# EAGLE design Basic (EAGLE 6.5.0)

## Sheet 1 of 7
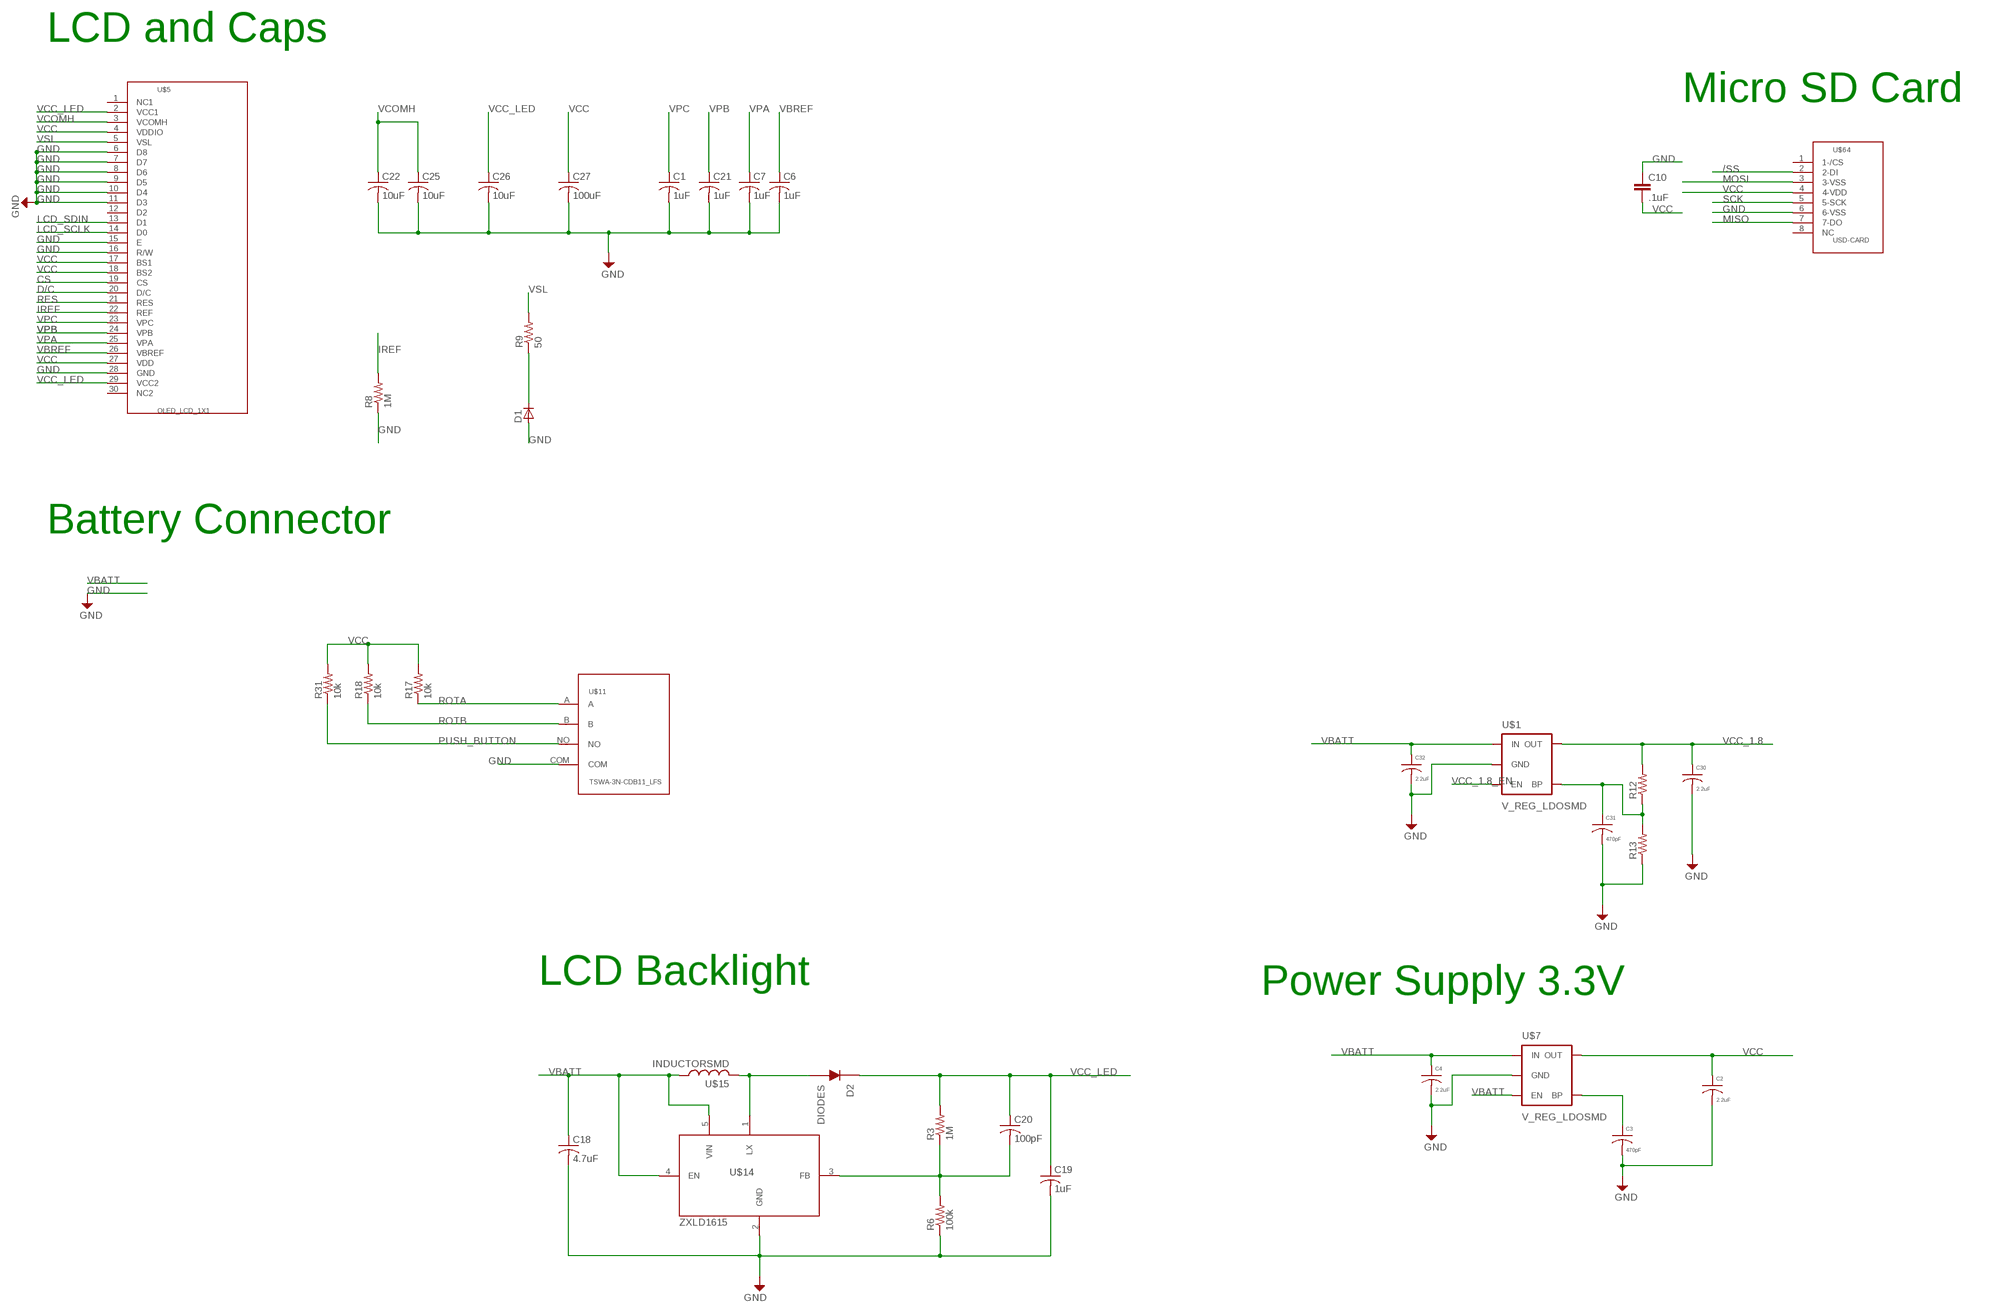
[diagram p0: schematic, sheet 1]

### Parts
C1  1uF  C-USC0402  [C0402]
C2  2.2uF  C0402  [C0402]
C3  470pF  C0402  [C0402]
C4  2.2uF  C0402  [C0402]
C6  1uF  C-USC0402  [C0402]
C7  1uF  C-USC0402  [C0402]
C10  .1uF  C-EUC0402  [C0402]
C18  4.7uF  C-USC0805K  [C0805K]
C19  1uF  C-USC1206  [C1206]
C20  100pF  C-USC0402  [C0402]
C21  1uF  C-USC0402  [C0402]
C22  10uF  C-USC0603  [C0603]
C25  10uF  C-USC0603  [C0603]
C26  10uF  C-USC0603  [C0603]
C27  100uF  C-USC0603  [C0603]
C30  2.2uF  C0603  [C0603]
C31  470pF  C0402  [C0402]
C32  2.2uF  C0603  [C0603]
D1  D-SOD123  [SOD123]
D2  DIODES  [SOD-123]
R3  1M  R-US_R0805  [R0805]
R6  100k  R-US_R0805  [R0805]
R8  1M  R-US_R0603  [R0603]
R9  50  R-US_R0603  [R0603]
R12  R-US_R0402  [R0402]
R13  R-US_R0402  [R0402]
R17  10k  R-US_R0402  [R0402]
R18  10k  R-US_R0402  [R0402]
R31  10k  R-US_R0402  [R0402]
U$1  V_REG_LDOSMD  [SOT23-5]
U$5  OLED_LCD_1X1  [30ZIF]
U$7  V_REG_LDOSMD  [SOT23-5]
U$11  TSWA-3N-CDB11_LFS  [TSWA-3N-CB11_LFS]
U$14  ZXLD1615  [SOT23-5L]
U$15  INDUCTORSMD  [INDUCTORSMD1]
U$64  USD-CARD  [502774-0891]

### Nets
/SS: U$64.2(2-DI) ; also sheet 2
CS: U$5.19(CS) ; also sheet 2
D/C: U$5.20(D/C) ; also sheet 2
GND: C1.2 C2.2 C3.2 C4.2 C6.2 C7.2 C10.1 C18.2 C19.2 C21.2 C22.2 C25.2 C26.2 C27.2 C30.2 C31.2 C32.2 D1.2(A) R6.1 R8.1 R13.1 U$1.2(GND) U$5.6(D8) U$5.7(D7) U$5.8(D6) U$5.9(D5) U$5.10(D4) U$5.11(D3) U$5.15(E) U$5.16(R/W) U$5.28(GND) U$7.2(GND) U$11.COM U$14.2(GND) U$64.6(6-VSS) ; also sheet 2,3,6,7
IREF: R8.2 U$5.22(REF)
LCD_SCLK: U$5.14(D0) ; also sheet 2
LCD_SDIN: U$5.13(D1) ; also sheet 2
MISO: U$64.7(7-DO) ; also sheet 2
MOSI: U$64.3(3-VSS) ; also sheet 2
N$2: C3.1 U$7.4(BP)
N$3: C20.2 R3.1 R6.2 U$14.3(FB)
N$5: D1.1(C) R9.1
N$9: D2.1(A1) U$14.1(LX) U$15.2
N$50: C31.1 R12.1 R13.2 U$1.4(BP)
PUSH_BUTTON: R31.1 U$11.NO ; also sheet 2
RES: U$5.21(RES) ; also sheet 2
ROTA: R17.1 U$11.A ; also sheet 2
ROTB: R18.1 U$11.B ; also sheet 2
SCK: U$64.5(5-SCK) ; also sheet 2
VBATT: C4.1 C18.1 C32.1 U$1.1(IN) U$7.1(IN) U$7.3(EN) U$14.4(EN) U$14.5(VIN) U$15.1 ; also sheet 6,7
VBREF: C6.1 U$5.26(VBREF)
VCC: C2.1 C10.2 C27.1 R17.2 R18.2 R31.2 U$5.4(VDDIO) U$5.17(BS1) U$5.18(BS2) U$5.27(VDD) U$7.5(OUT) U$64.4(4-VDD) ; also sheet 2,3
VCC_1.8: C30.1 R12.2 U$1.5(OUT) ; also sheet 7
VCC_1.8_EN: U$1.3(EN) ; also sheet 2
VCC_LED: C19.1 C20.1 C26.1 D2.2(C) R3.2 U$5.2(VCC1) U$5.29(VCC2)
VCOMH: C22.1 C25.1 U$5.3(VCOMH)
VPA: C7.1 U$5.25(VPA)
VPB: C21.1 U$5.24(VPB)
VPC: C1.1 U$5.23(VPC)
VSL: R9.2 U$5.5(VSL)
Unconnected: U$5.1(NC1) U$5.12(D2) U$5.30(NC2) U$64.1(1-/CS) U$64.8(NC)

### Notes on the sheet
- LCD and Caps
- Micro SD Card
- Battery Connector
- LCD Backlight | Power Supply 3.3V

## Sheet 2 of 7
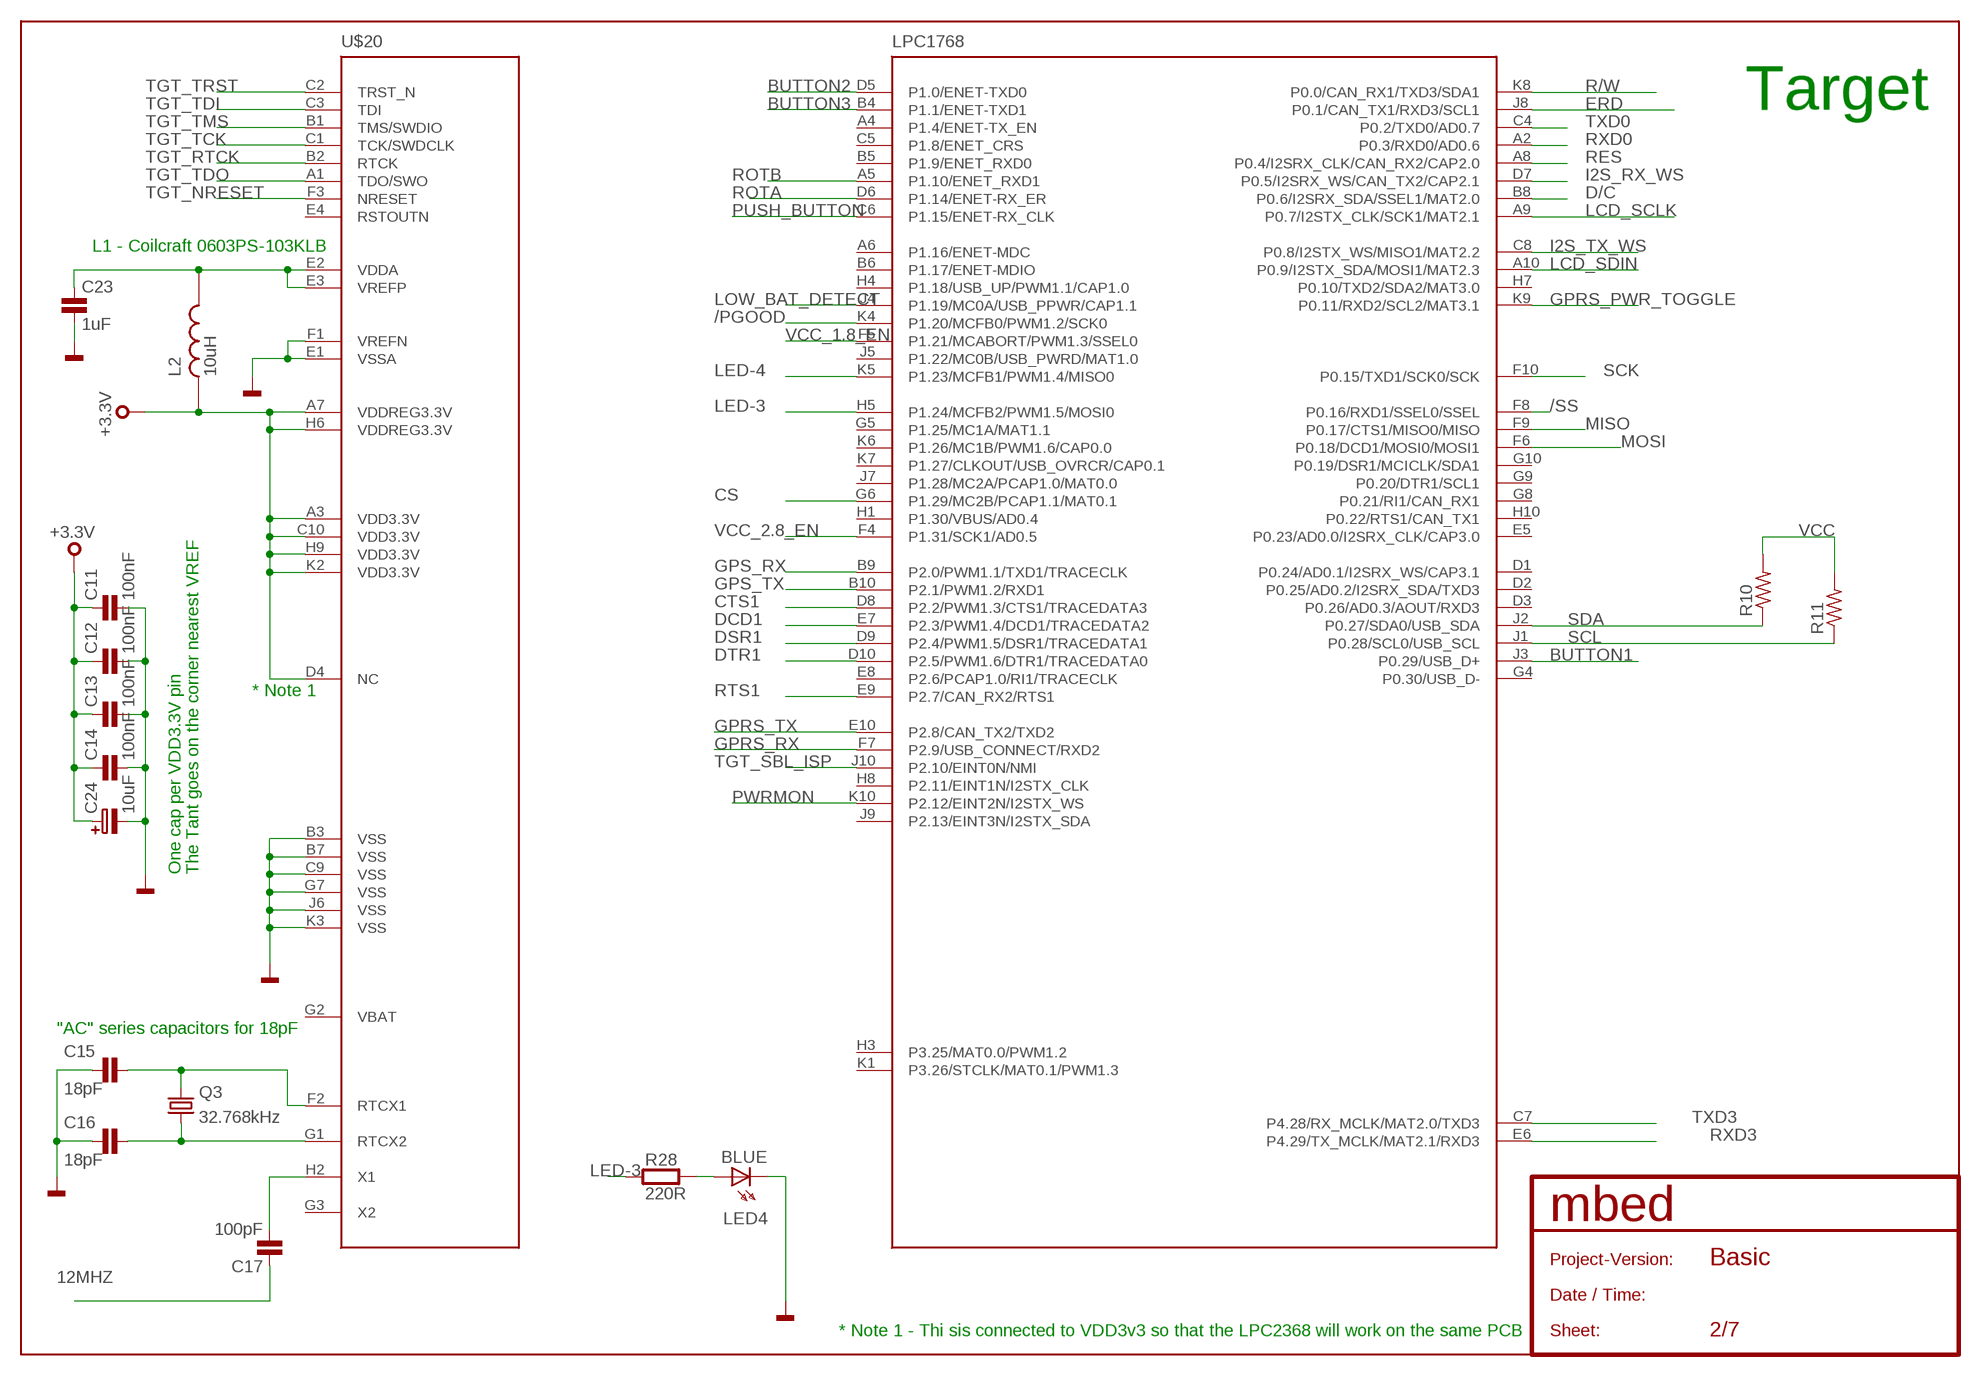
[diagram p1: schematic, sheet 2]

### Parts
C11  100nF  C0402  [0402]
C12  100nF  C0402  [0402]
C13  100nF  C0402  [0402]
C14  100nF  C0402  [0402]
C15  18pF  C0402  [0402]
C16  18pF  C0402  [0402]
C17  100pF  C0402  [0402]
C23  1uF  C0805  [0805]
C24  10uF  C-POLARISEDSMT_TANTALUM  [C106B]
L2  10uH  L_L  [L0603]
LED4  BLUE  LED_0805  [LED_0805]
Q3  32.768kHz  CRYSTALFC135  [FC135]
R10  R-US_R0402  [R0402]
R11  R-US_R0402  [R0402]
R28  220R  R0402  [0402]
U$20  LPC1768  [TFBGA100]

### Nets
12MHZ: C17.1 ; also sheet 3
/PGOOD: U$20.K4(P1.20/MCFB0/PWM1.2/SCK0)
/SS: U$20.F8(P0.16/RXD1/SSEL0/SSEL) ; also sheet 1
BUTTON1: U$20.J3(P0.29/USB_D+)
BUTTON2: U$20.D5(P1.0/ENET-TXD0)
BUTTON3: U$20.B4(P1.1/ENET-TXD1)
CS: U$20.G6(P1.29/MC2B/PCAP1.1/MAT0.1) ; also sheet 1
CTS1: U$20.D8(P2.2/PWM1.3/CTS1/TRACEDATA3)
D/C: U$20.B8(P0.6/I2SRX_SDA/SSEL1/MAT2.0) ; also sheet 1
DCD1: U$20.E7(P2.3/PWM1.4/DCD1/TRACEDATA2)
DSR1: U$20.D9(P2.4/PWM1.5/DSR1/TRACEDATA1)
DTR1: U$20.D10(P2.5/PWM1.6/DTR1/TRACEDATA0)
ERD: U$20.J8(P0.1/CAN_TX1/RXD3/SCL1)
GND: C11.2 C12.2 C13.2 C14.2 C15.1 C16.1 C23.2 C24.2 LED4.K U$20.B3(VSS) U$20.B7(VSS) U$20.C9(VSS) U$20.E1(VSSA) U$20.F1(VREFN) U$20.G7(VSS) U$20.J6(VSS) U$20.K3(VSS) ; also sheet 1,3,6,7
GPRS_PWR_TOGGLE: U$20.K9(P0.11/RXD2/SCL2/MAT3.1) ; also sheet 7
GPRS_RX: U$20.F7(P2.9/USB_CONNECT/RXD2) ; also sheet 7
GPRS_TX: U$20.E10(P2.8/CAN_TX2/TXD2) ; also sheet 7
GPS_RX: U$20.B9(P2.0/PWM1.1/TXD1/TRACECLK) ; also sheet 7
GPS_TX: U$20.B10(P2.1/PWM1.2/RXD1) ; also sheet 7
I2S_RX_WS: U$20.D7(P0.5/I2SRX_WS/CAN_TX2/CAP2.1)
I2S_TX_WS: U$20.C8(P0.8/I2STX_WS/MISO1/MAT2.2)
IC6_RTC1: C15.2 Q3.X2 U$20.F2(RTCX1)
IC6_RTC2: C16.2 Q3.X1 U$20.G1(RTCX2)
IC6_XTAL1: C17.2 U$20.H2(X1)
LCD_SCLK: U$20.A9(P0.7/I2STX_CLK/SCK1/MAT2.1) ; also sheet 1
LCD_SDIN: U$20.A10(P0.9/I2STX_SDA/MOSI1/MAT2.3) ; also sheet 1
LED-3: R28.1 U$20.H5(P1.24/MCFB2/PWM1.5/MOSI0)
LED-4: U$20.K5(P1.23/MCFB1/PWM1.4/MISO0)
LOW_BAT_DETECT: U$20.J4(P1.19/MC0A/USB_PPWR/CAP1.1)
MISO: U$20.F9(P0.17/CTS1/MISO0/MISO) ; also sheet 1
MOSI: U$20.F6(P0.18/DCD1/MOSI0/MOSI1) ; also sheet 1
N$18: LED4.A R28.2
N$19: C23.1 L2.P$2 U$20.E2(VDDA) U$20.E3(VREFP)
PUSH_BUTTON: U$20.C6(P1.15/ENET-RX_CLK) ; also sheet 1
PWRMON: U$20.K10(P2.12/EINT2N/I2STX_WS) ; also sheet 7
R/W: U$20.K8(P0.0/CAN_RX1/TXD3/SDA1)
RES: U$20.A8(P0.4/I2SRX_CLK/CAN_RX2/CAP2.0) ; also sheet 1
ROTA: U$20.D6(P1.14/ENET-RX_ER) ; also sheet 1
ROTB: U$20.A5(P1.10/ENET_RXD1) ; also sheet 1
RTS1: U$20.E9(P2.7/CAN_RX2/RTS1)
RXD0: U$20.A2(P0.3/RXD0/AD0.6) ; also sheet 6
RXD3: U$20.E6(P4.29/TX_MCLK/MAT2.1/RXD3)
SCK: U$20.F10(P0.15/TXD1/SCK0/SCK) ; also sheet 1
SCL: R11.1 U$20.J1(P0.28/SCL0/USB_SCL)
SDA: R10.1 U$20.J2(P0.27/SDA0/USB_SDA)
TGT_NRESET: U$20.F3(NRESET) ; also sheet 3
TGT_RTCK: U$20.B2(RTCK)
TGT_SBL_ISP: U$20.J10(P2.10/EINT0N/NMI) ; also sheet 3
TGT_TCK: U$20.C1(TCK/SWDCLK)
TGT_TDI: U$20.C3(TDI)
TGT_TDO: U$20.A1(TDO/SWO)
TGT_TMS: U$20.B1(TMS/SWDIO)
TGT_TRST: U$20.C2(TRST_N)
TXD0: U$20.C4(P0.2/TXD0/AD0.7) ; also sheet 6
TXD3: U$20.C7(P4.28/RX_MCLK/MAT2.0/TXD3)
VCC: C11.1 C12.1 C13.1 C14.1 C24.1 L2.P$1 R10.2 R11.2 U$20.A3(VDD3.3V) U$20.A7(VDDREG3.3V) U$20.C10(VDD3.3V) U$20.D4(NC) U$20.H6(VDDREG3.3V) U$20.H9(VDD3.3V) U$20.K2(VDD3.3V) ; supply symbol labelled +3.3V ; also sheet 1,3
VCC_1.8_EN: U$20.F5(P1.21/MCABORT/PWM1.3/SSEL0) ; also sheet 1
VCC_2.8_EN: U$20.F4(P1.31/SCK1/AD0.5)
Unconnected: U$20.A4(P1.4/ENET-TX_EN) U$20.A6(P1.16/ENET-MDC) U$20.B5(P1.9/ENET_RXD0) U$20.B6(P1.17/ENET-MDIO) U$20.C5(P1.8/ENET_CRS) U$20.D1(P0.24/AD0.1/I2SRX_WS/CAP3.1) U$20.D2(P0.25/AD0.2/I2SRX_SDA/TXD3) U$20.D3(P0.26/AD0.3/AOUT/RXD3) U$20.E4(RSTOUTN) U$20.E5(P0.23/AD0.0/I2SRX_CLK/CAP3.0) U$20.E8(P2.6/PCAP1.0/RI1/TRACECLK) U$20.G2(VBAT) U$20.G3(X2) U$20.G4(P0.30/USB_D-) U$20.G5(P1.25/MC1A/MAT1.1) U$20.G8(P0.21/RI1/CAN_RX1) U$20.G9(P0.20/DTR1/SCL1) U$20.G10(P0.19/DSR1/MCICLK/SDA1) U$20.H1(P1.30/VBUS/AD0.4) U$20.H3(P3.25/MAT0.0/PWM1.2) U$20.H4(P1.18/USB_UP/PWM1.1/CAP1.0) U$20.H7(P0.10/TXD2/SDA2/MAT3.0) U$20.H8(P2.11/EINT1N/I2STX_CLK) U$20.H10(P0.22/RTS1/CAN_TX1) U$20.J5(P1.22/MC0B/USB_PWRD/MAT1.0) U$20.J7(P1.28/MC2A/PCAP1.0/MAT0.0) U$20.J9(P2.13/EINT3N/I2STX_SDA) U$20.K1(P3.26/STCLK/MAT0.1/PWM1.3) U$20.K6(P1.26/MC1B/PWM1.6/CAP0.0) U$20.K7(P1.27/CLKOUT/USB_OVRCR/CAP0.1)

### Notes on the sheet
- Target
- L1 - Coilcraft 0603PS-103KLB
- * Note 1
- One cap per VDD3.3V pin | The Tant goes on the corner nearest VREF
- "AC" series capacitors for 18pF
- * Note 1 - Thi sis connected to VDD3v3 so that the LPC2368 will work on the same PCB

## Sheet 3 of 7
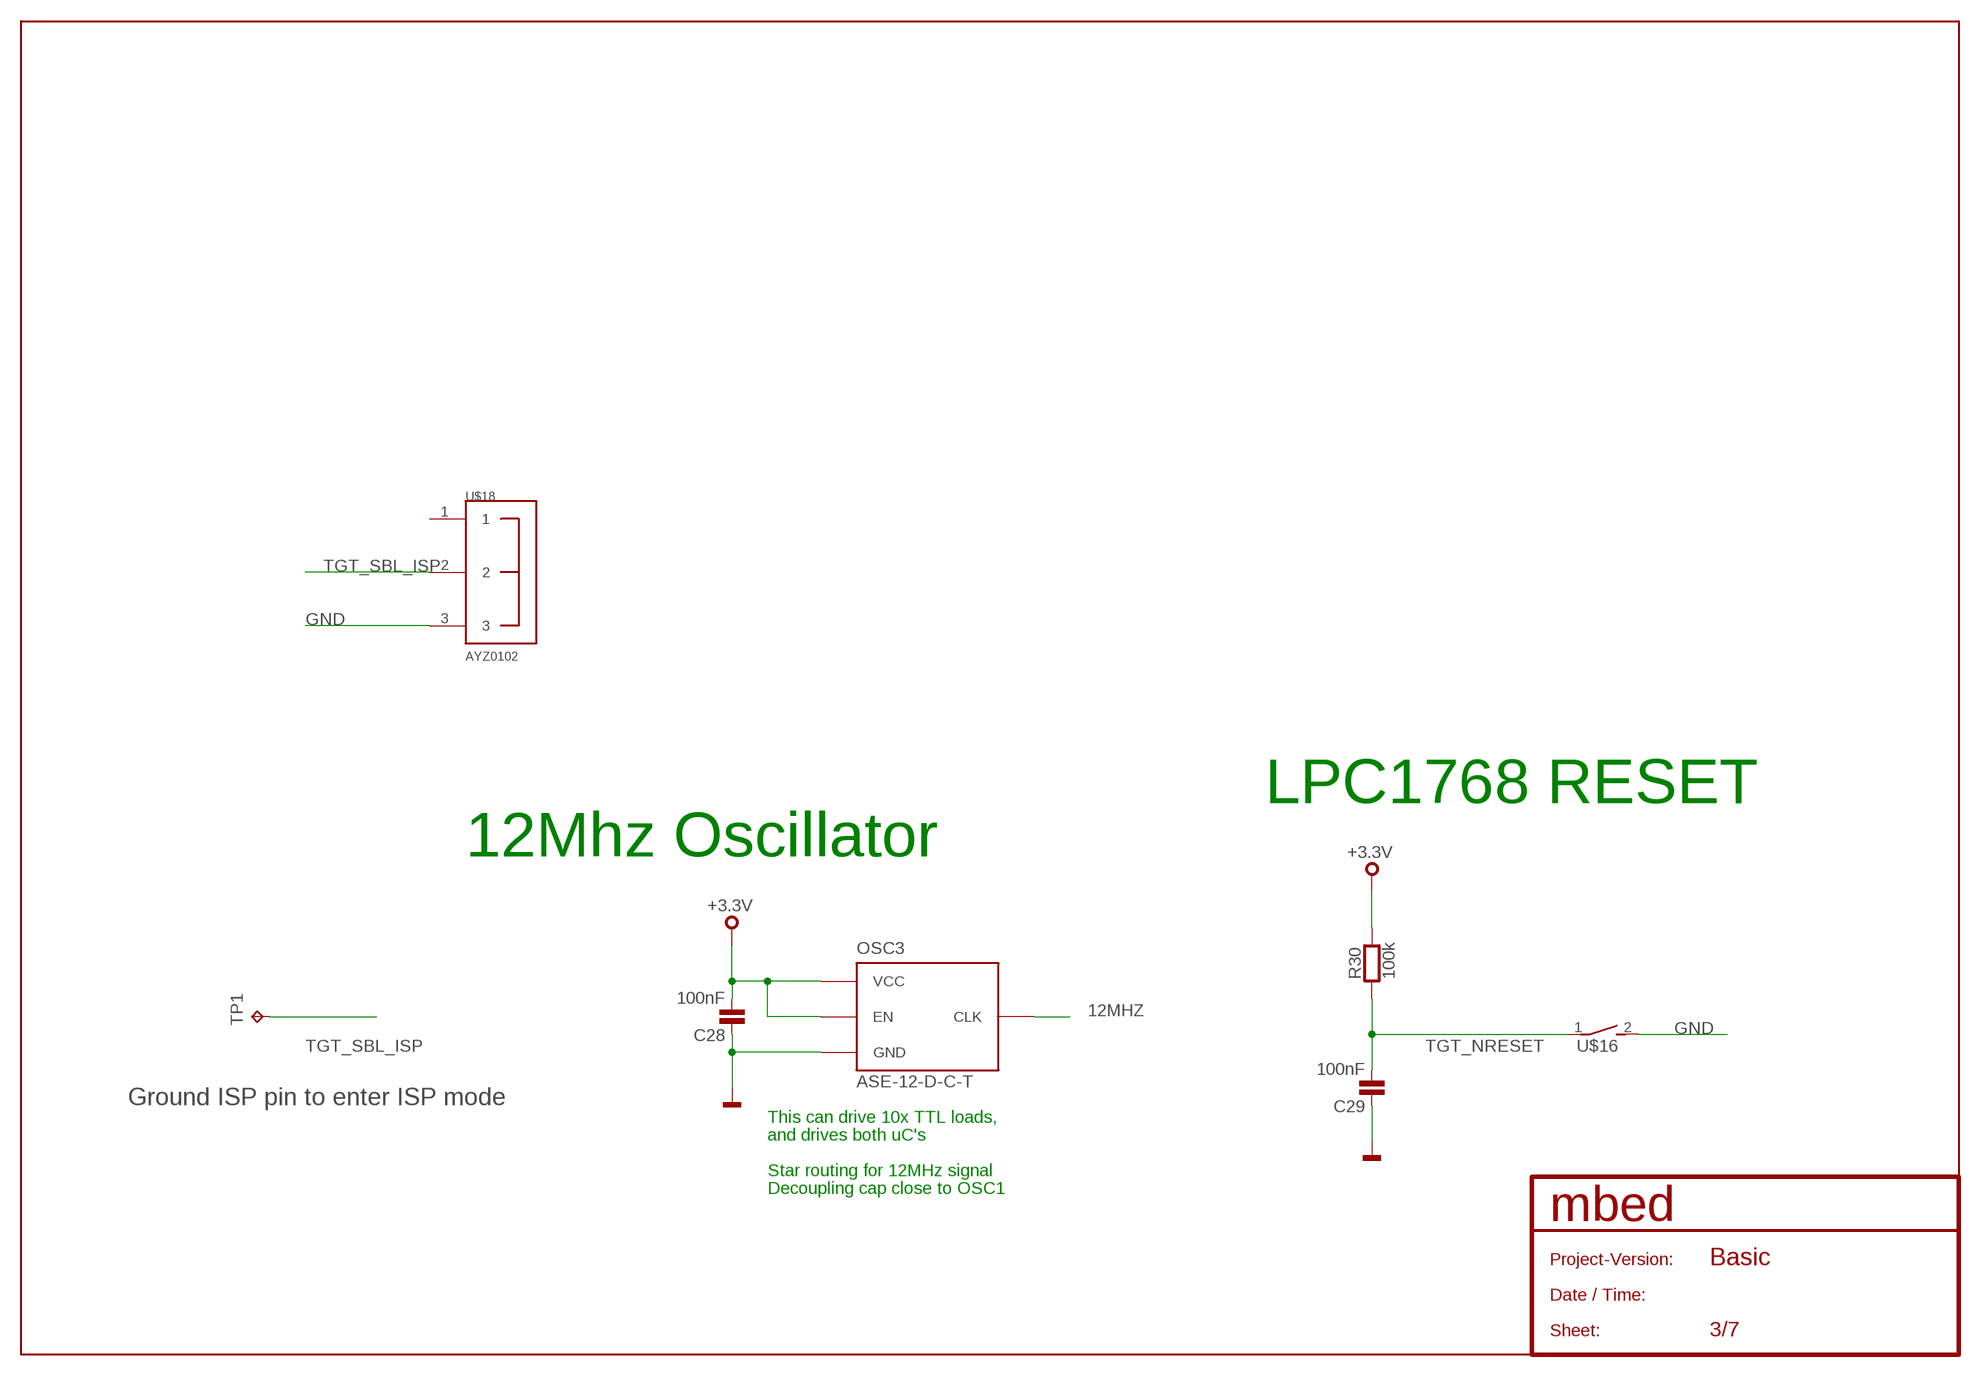
[diagram p2: schematic, sheet 3]

### Parts
C28  100nF  C0402  [0402]
C29  100nF  C0402  [0402]
OSC3  ASE-12-D-C-T  OSCILLATOR_2.5X3.2  [OSC3.2X.2.5]
R30  100k  R0402  [0402]
TP1  TPTP09R  [TP09R]
U$16  RGHT-ANGLE-SMT-SWITCH-688-SKRELF  [2.9X3.9X2.0]
U$18  AYZ0102  [AYZ0102]

### Nets
12MHZ: OSC3.P$3(CLK) ; also sheet 2
GND: C28.1 C29.1 OSC3.P$2(GND) U$16.2 U$18.3 ; also sheet 1,2,6,7
TGT_NRESET: C29.2 R30.1 U$16.1 ; also sheet 2
TGT_SBL_ISP: TP1.TP U$18.2 ; also sheet 2
VCC: C28.2 OSC3.P$1(EN) OSC3.P$4(VCC) R30.2 ; supply symbol labelled +3.3V ; also sheet 1,2
Unconnected: U$18.1

### Notes on the sheet
- LPC1768 RESET
- 12Mhz Oscillator
- Ground ISP pin to enter ISP mode
- This can drive 10x TTL loads,
- and drives both uC's
- Star routing for 12MHz signal
- Decoupling cap close to OSC1

## Sheet 4 of 7

## Sheet 5 of 7
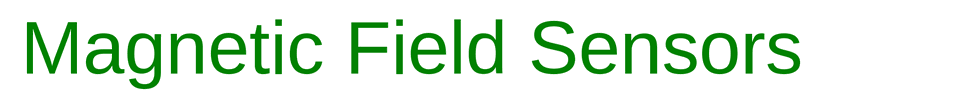
[diagram p3: schematic, sheet 5]

### Notes on the sheet
- Magnetic Field Sensors

## Sheet 6 of 7
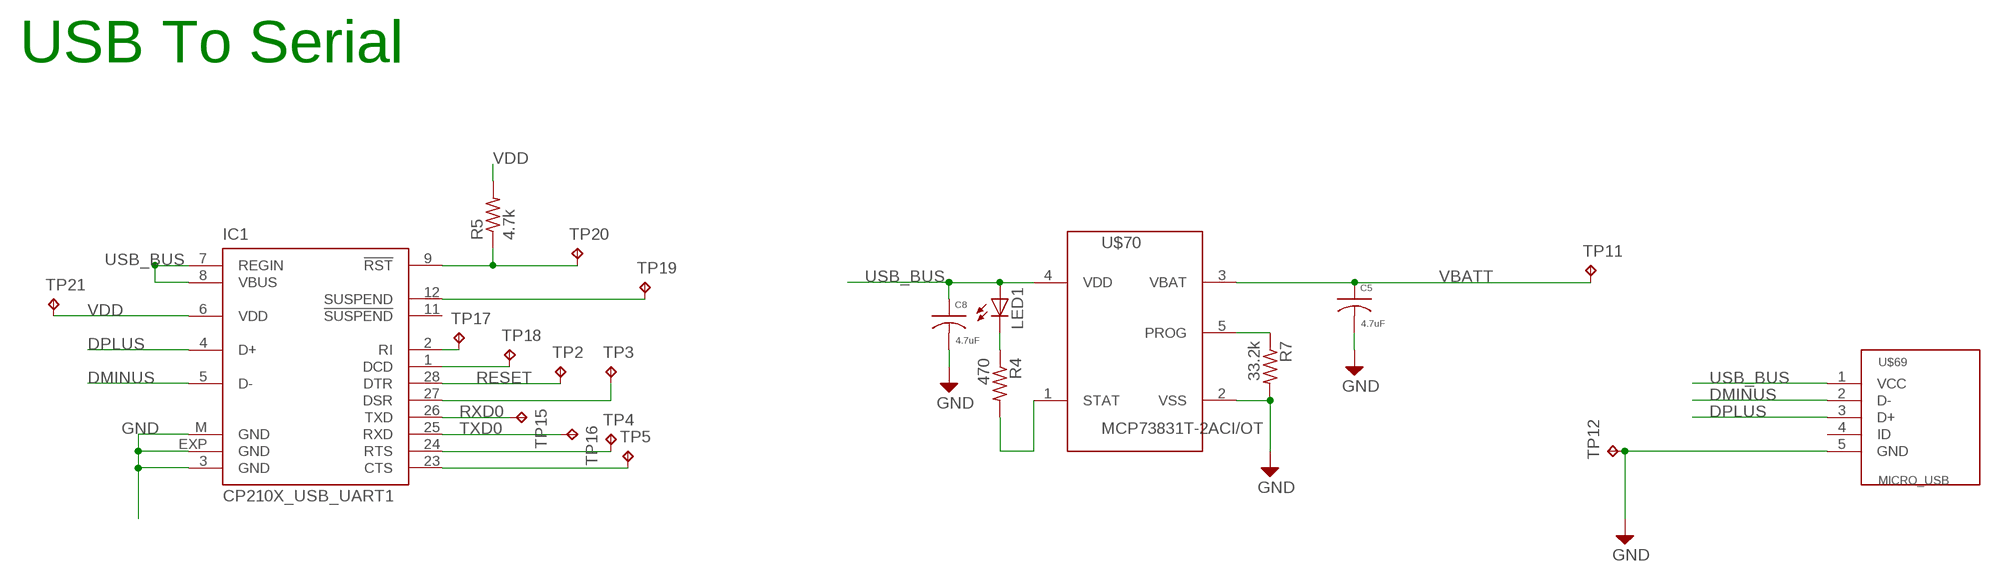
[diagram p4: schematic, sheet 6]

### Parts
C5  4.7uF  C0603  [C0603]
C8  4.7uF  C0603  [C0603]
IC1  CP210X_USB_UART1  [MLP28]
LED1  LEDCHIP-LED0603  [CHIP-LED0603]
R4  470  R-US_R0402  [R0402]
R5  4.7k  R-US_R0402  [R0402]
R7  33.2k  R-US_R0402  [R0402]
TP2  TPTP06R  [TP06R]
TP3  TPTP06R  [TP06R]
TP4  TPTP06R  [TP06R]
TP5  TPTP06R  [TP06R]
TP11  TPTP20SQ  [TP20SQ]
TP12  TPTP20SQ  [TP20SQ]
TP15  TPTP06R  [TP06R]
TP16  TPTP06R  [TP06R]
TP17  TPTP06R  [TP06R]
TP18  TPTP06R  [TP06R]
TP19  TPTP06R  [TP06R]
TP20  TPTP06R  [TP06R]
TP21  TPTP06R  [TP06R]
U$69  MICRO_USB  [MICRO_USB]
U$70  MCP73831T-2ACI/OT  [SOT23-5L]

### Nets
CHG_STAT: R4.2 U$70.1(STAT)
DMINUS: IC1.5(D-) U$69.2(D-)
DPLUS: IC1.4(D+) U$69.3(D+)
GND: C5.2 C8.2 IC1.3(GND) IC1.EXP(GND) IC1.M(GND) R7.2 TP12.TP U$69.5(GND) U$70.2(VSS) ; also sheet 1,2,3,7
N$1: IC1.9(!RST) R5.1 TP20.TP
N$8: IC1.24(RTS) TP4.TP
N$11: IC1.23(CTS) TP5.TP
N$13: IC1.27(DSR) TP3.TP
N$34: IC1.2(RI) TP17.TP
N$35: IC1.1(DCD) TP18.TP
N$36: IC1.12(SUSPEND) TP19.TP
N$48: LED1.C R4.1
N$49: R7.1 U$70.5(PROG)
RESET: IC1.28(DTR) TP2.TP
RXD0: IC1.26(TXD) TP15.TP ; also sheet 2
TXD0: IC1.25(RXD) TP16.TP ; also sheet 2
USB_BUS: C8.1 IC1.7(REGIN) IC1.8(VBUS) LED1.A U$69.1(VCC) U$70.4(VDD)
VBATT: C5.1 TP11.TP U$70.3(VBAT) ; also sheet 1,7
VDD: IC1.6(VDD) R5.2 TP21.TP
Unconnected: IC1.11(!SUSPEND) U$69.4(ID)

### Notes on the sheet
- USB To Serial

## Sheet 7 of 7
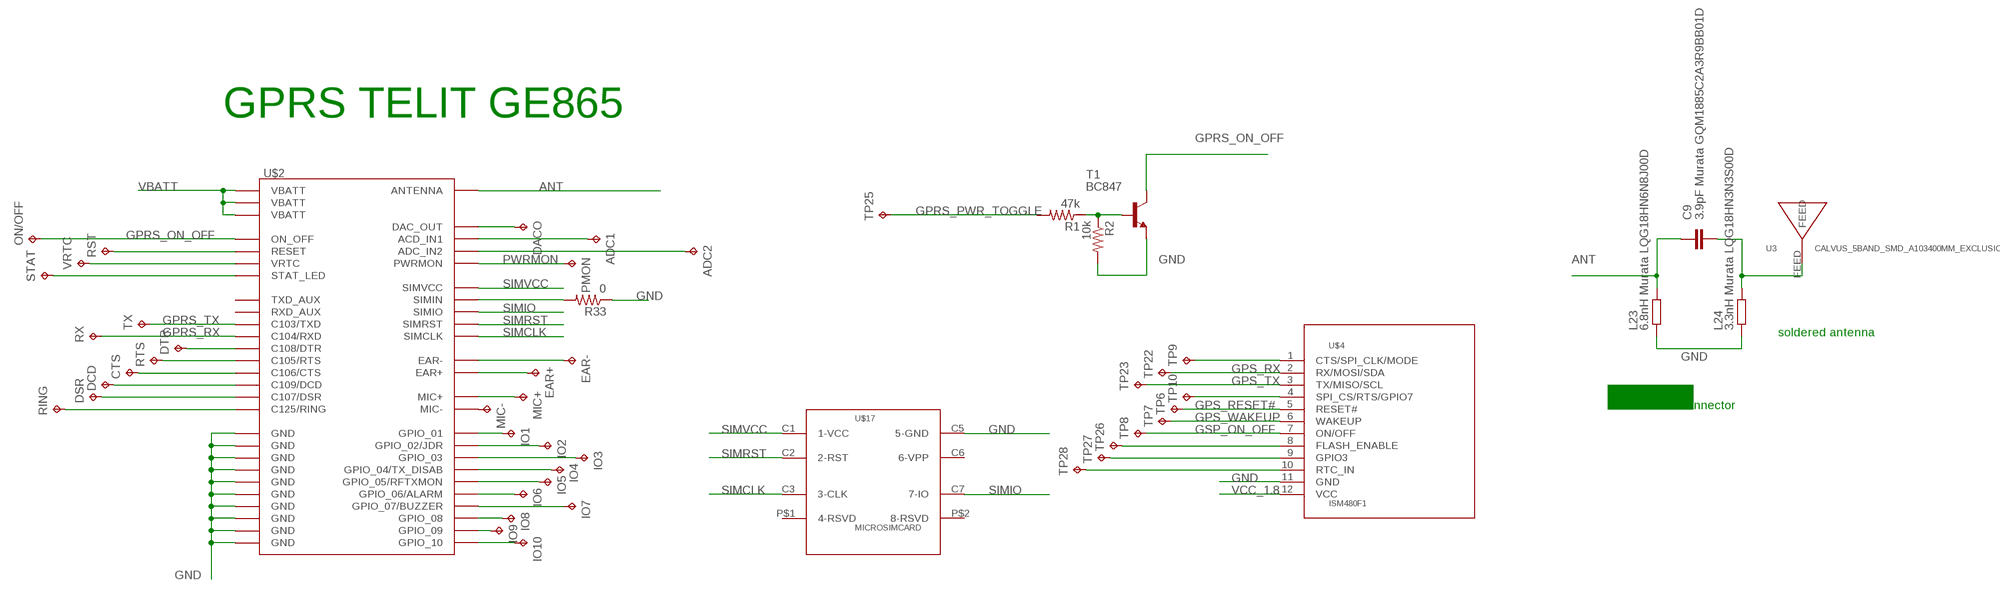
[diagram p5: schematic, sheet 7]

### Parts
ADC1  TPTP06R  [TP06R]
ADC2  TPTP06R  [TP06R]
C9  3.9pF Murata GQM1885C2A3R9BB01D  C-EU0603-RND  [C0603-ROUND]
CTS  TPTP06R  [TP06R]
DACO  TPTP06R  [TP06R]
DCD  TPTP06R  [TP06R]
DSR  TPTP06R  [TP06R]
DTR  TPTP06R  [TP06R]
EAR+  TPTP06R  [TP06R]
EAR-  TPTP06R  [TP06R]
IO1  TPTP06R  [TP06R]
IO2  TPTP06R  [TP06R]
IO3  TPTP06R  [TP06R]
IO4  TPTP06R  [TP06R]
IO5  TPTP06R  [TP06R]
IO6  TPTP06R  [TP06R]
IO7  TPTP06R  [TP06R]
IO8  TPTP06R  [TP06R]
IO9  TPTP06R  [TP06R]
IO10  TPTP06R  [TP06R]
L23  6.8nH Murata LQG18HN6N8J00D  R-EU_0603-RND  [R0603-ROUND]
L24  3.3nH Murata LQG18HN3N3S00D  R-EU_0603-RND  [R0603-ROUND]
MIC+  TPTP06R  [TP06R]
MIC-  TPTP06R  [TP06R]
ON/OFF  TPTP06R  [TP06R]
PMON  TPTP06R  [TP06R]
R1  47k  R-US_R0402  [R0402]
R2  10k  R-US_R0402  [R0402]
R33  0  R-US_R0402  [R0402]
RING  TPTP06R  [TP06R]
RST  TPTP06R  [TP06R]
RTS  TPTP06R  [TP06R]
RX  TPTP06R  [TP06R]
STAT  TPTP06R  [TP06R]
T1  BC847  [SOT23]
TP6  TPTP06R  [TP06R]
TP7  TPTP06R  [TP06R]
TP8  TPTP06R  [TP06R]
TP9  TPTP06R  [TP06R]
TP10  TPTP06R  [TP06R]
TP22  TPTP06R  [TP06R]
TP23  TPTP06R  [TP06R]
TP25  TPTP06R  [TP06R]
TP26  TPTP06R  [TP06R]
TP27  TPTP06R  [TP06R]
TP28  TPTP06R  [TP06R]
TX  TPTP06R  [TP06R]
U3  CALVUS_5BAND_SMD_A103400MM_EXCLUSION  [CALVUS_5BAND_SMD_A10340_0MM_EXCLUSION]
U$2  GE865  [GE865]
U$4  ISM480F1  [20488-012E-01]
U$17  MICROSIMCARD  [FMS006-5000-0]
VRTC  TPTP06R  [TP06R]

### Nets
ANT [antenna]: C9.1 L23.2 U$2.H5(ANTENNA)
ANTENA [antenna]: C9.2 L24.2 U3.FEED
GND: L23.1 L24.1 R2.2 R33.1 T1.2(E) U$2.C2(GND) U$2.C7(GND) U$2.E5(GND) U$2.E7(GND) U$2.G1(GND) U$2.G3(GND) U$2.G4(GND) U$2.G5(GND) U$2.H3(GND) U$2.H6(GND) U$4.11(GND) U$17.C5(5-GND) ; also sheet 1,2,3,6
GPRS_ON_OFF: ON/OFF.TP T1.3(C) U$2.B1(ON_OFF)
GPRS_PWR_TOGGLE: R1.2 TP25.TP ; also sheet 2
GPRS_RX: RX.TP U$2.A4(C104/RXD) ; also sheet 2
GPRS_TX: TX.TP U$2.A3(C103/TXD) ; also sheet 2
GPS_RESET#: TP6.TP U$4.5(RESET#)
GPS_RX: TP22.TP U$4.2(RX/MOSI/SDA) ; also sheet 2
GPS_TX: TP23.TP U$4.3(TX/MISO/SCL) ; also sheet 2
GPS_WAKEUP: TP7.TP U$4.6(WAKEUP)
GSP_ON_OFF: TP8.TP U$4.7(ON/OFF)
N$4: R33.2 U$2.B7(SIMIN)
N$7: R1.1 R2.1 T1.1(B)
N$10: RST.TP U$2.C1(RESET)
N$12: U$2.H2(VRTC) VRTC.TP
N$14: STAT.TP U$2.G8(STAT_LED)
N$15: EAR-.TP U$2.E8(EAR-)
N$16: TP9.TP U$4.1(CTS/SPI_CLK/MODE)
N$17: EAR+.TP U$2.D8(EAR+)
N$20: MIC+.TP U$2.B8(MIC+)
N$21: MIC-.TP U$2.C8(MIC-)
N$22: TP10.TP U$4.4(SPI_CS/RTS/GPIO7)
N$23: IO7.TP U$2.G6(GPIO_07/BUZZER)
N$24: IO6.TP U$2.H8(GPIO_06/ALARM)
N$25: IO5.TP U$2.G2(GPIO_05/RFTXMON)
N$26: IO8.TP U$2.D4(GPIO_08)
N$27: IO9.TP U$2.F4(GPIO_09)
N$28: DTR.TP U$2.B3(C108/DTR)
N$29: RING.TP U$2.B4(C125/RING)
N$30: DSR.TP U$2.B2(C107/DSR)
N$31: DCD.TP U$2.B5(C109/DCD)
N$32: CTS.TP U$2.A2(C106/CTS)
N$33: RTS.TP U$2.A1(C105/RTS)
N$37: TP26.TP U$4.8(FLASH_ENABLE)
N$38: TP27.TP U$4.9(GPIO3)
N$39: TP28.TP U$4.10(RTC_IN)
N$40: IO1.TP U$2.D3(GPIO_01)
N$41: IO2.TP U$2.D2(GPIO_02/JDR)
N$42: IO3.TP U$2.E4(GPIO_03)
N$43: IO4.TP U$2.H7(GPIO_04/TX_DISAB)
N$44: DACO.TP U$2.G7(DAC_OUT)
N$45: ADC1.TP U$2.F5(ACD_IN1)
N$46: ADC2.TP U$2.F6(ADC_IN2)
N$47: IO10.TP U$2.E3(GPIO_10)
PWRMON: PMON.TP U$2.E2(PWRMON) ; also sheet 2
SIMCLK: U$2.A5(SIMCLK) U$17.C3(3-CLK)
SIMIO: U$2.A6(SIMIO) U$17.C7(7-IO)
SIMRST: U$2.A8(SIMRST) U$17.C2(2-RST)
SIMVCC: U$2.A7(SIMVCC) U$17.C1(1-VCC)
VBATT: U$2.F1(VBATT) U$2.F2(VBATT) U$2.F3(VBATT) ; also sheet 1,6
VCC_1.8: U$4.12(VCC) ; also sheet 1
Unconnected: U$2.D1(TXD_AUX) U$2.E1(RXD_AUX) U$17.C6(6-VPP) U$17.P$1(4-RSVD) U$17.P$2(8-RSVD)

### Notes on the sheet
- GPRS TELIT GE865
- soldered antenna
- SMA or U.FL connector

## Library data of the parts
ADC1 ADC2 CTS DACO DCD DSR DTR EAR+ EAR- IO1-IO10 MIC+ MIC- ON/OFF PMON RING RST RTS RX STAT TP1-TP12 TP15-TP23 TP25-TP28 TX VRTC = testpad:TP: Test pad
C1 C6 C7 C18-C22 C25-C27 = rcl:C-US: CAPACITOR, American symbol
C2-C5 C8 C30-C32 = qualified_1:C
C9 = SmartPrj:C-EU: CAPACITOR, European symbol
C10 = rcl:C-EU: CAPACITOR, European symbol
C11-C17 C23 C28 C29 = mbed:C
C24 = mbed:C-POLARISED
D1 = semicon-smd-ipc:D-: DIODE unfilled
D2 = m-pad-2.0:DIODES: Various Diodes: Diodes Inc BAS16/MMBD4148/MMBD914 SURFACE MOUNT SWITCHING DIODE Features: Fast Switching Speed Surface Mount Package Ideally Suited for Automatic Insertion For General Purpose Switching Applications High Conductance Available in Lead Free/RoHS Compliant Version (Note 3) Qualified to AEC-Q101 Standards for High Reliability Central Semiconductor's CMSD4448 SURFACE MOUNT SUPERmini HIGH SPEED SILICON SWITCHING DIODE DESCRIPTION: The CENTRAL SEMICONDUCTOR CMSD4448 type is a ultra-high speed silicon switching diode manufactured by the epitaxial planar process, in an epoxy molded SUPERminiTM surface mount package, designed for high switching applications. MARKING CODE: ADA
IC1 = SparkFun-3-2-07:CP210X_USB_UART: Single-Chip USB to UART Bridge Source: www.silabs.com .. CP2101.pdf / cp2102.pdf. Spark Fun Electronics SKU : IC-CP2102
L2 = mbed:L
L23 L24 = SmartPrj:R-EU_: RESISTOR, European symbol
LED1 = led:LED: LED OSRAM: - CHIPLED LG R971, LG N971, LY N971, LG Q971, LY Q971, LO R971, LY R971 LH N974, LH R974 LS Q976, LO Q976, LY Q976 LO Q996 - Hyper CHIPLED LW Q18S LB Q993, LB Q99A, LB R99A - SideLED LS A670, LO A670, LY A670, LG A670, LP A670 LB A673, LV A673, LT A673, LW A673 LH A674 LY A675 LS A676, LA A676, LO A676, LY A676, LW A676 LS A679, LY A679, LG A679 - Hyper Micro SIDELED® LS Y876, LA Y876, LO Y876, LY Y876 LT Y87S - SmartLED LW L88C, LW L88S LB L89C, LB L89S, LG L890 LS L89K, LO L89K, LY L89K LS L896, LA L896, LO L896, LY L896 - TOPLED LS T670, LO T670, LY T670, LG T670, LP T670 LSG T670, LSP T670, LSY T670, LOP T670, LYG T670 LG T671, LOG T671, LSG T671 LB T673, LV T673, LT T673, LW T673 LH T674 LS T676, LA T676, LO T676, LY T676, LB T676, LH T676, LSB T676, LW T676 LB T67C, LV T67C, LT T67C, LS T67K, LO T67K, LY T67K, LW E67C LS E67B, LA E67B, LO E67B, LY E67B, LB E67C, LV E67C, LT E67C LW T67C LS T679, LY T679, LG T679 LS T770, LO T770, LY T770, LG T770, LP T770 LB T773, LV T773, LT T773, LW T773 LH T774 LS E675, LA E675, LY E675, LS T675 LS T776, LA T776, LO T776, LY T776, LB T776 LHGB T686 LT T68C, LB T68C - Hyper Mini TOPLED® LB M676 - Mini TOPLED Santana® LG M470 LS M47K, LO M47K, LY M47K Source: http://www.osram.convergy.de LUXEON: - LUMILED® LXK2-PW12-R00, LXK2-PW12-S00, LXK2-PW14-U00, LXK2-PW14-V00 LXK2-PM12-R00, LXK2-PM12-S00, LXK2-PM14-U00 LXK2-PE12-Q00, LXK2-PE12-R00, LXK2-PE12-S00, LXK2-PE14-T00, LXK2-PE14-U00 LXK2-PB12-K00, LXK2-PB12-L00, LXK2-PB12-M00, LXK2-PB14-N00, LXK2-PB14-P00, LXK2-PB14-Q00 LXK2-PR12-L00, LXK2-PR12-M00, LXK2-PR14-Q00, LXK2-PR14-R00 LXK2-PD12-Q00, LXK2-PD12-R00, LXK2-PD12-S00 LXK2-PH12-R00, LXK2-PH12-S00 LXK2-PL12-P00, LXK2-PL12-Q00, LXK2-PL12-R00 Source: www.luxeon.com KINGBRIGHT: KA-3528ASYC Source: www.kingbright.com
LED4 = mbed:LED
OSC3 = mbed:OSCILLATOR
Q3 = LPC1768RefDesign:CRYSTAL: CRYSTAL
R1 R2 R33 = resistor:R-US_: RESISTOR, American symbol
R3-R13 R17 R18 R31 = rcl:R-US_: RESISTOR, American symbol
R28 R30 = mbed:R
T1 = transistor:BC847: NPN TRANSISTOR
U3 = SmartPrj:CALVUS_5BAND_SMD_A10340
U$1 U$7 = SparkFun-3-2-07:V_REG_LDO: Voltage Regulator LDO Standard 150mA LDO voltage regulator in SOT-23 layout. Micrel part MIC5205. BP (by-pass) pin is used to lower output noise with 470pF cap.
U$2 = SparkFun:GE865
U$4 = m-pad-2.1:ISM480F1
U$5 = m-pad-2.0:OLED_LCD_1X1
U$11 = m-pad-2.1:TSWA-3N-CDB11_LFS
U$14 = m-pad-2.0:ZXLD1615
U$15 = m-pad-2.0:INDUCTORSMD
U$16 = m-pad-2.0:RGHT-ANGLE-SMT-SWITCH-688-SKRELF
U$17 = m-pad-2.1:MICROSIMCARD
U$18 = SparkFun-3-2-07:AYZ0102
U$20 = m-pad-2.1:LPC1768
U$64 = m-pad-2.1:USD-CARD
U$69 = camera_project:MICRO_USB
U$70 = m-pad-2.1:MCP73831T-2ACI/OT

## Net classes
3 battery: width 0.229 mm
4 antenna: clearance 0.61 mm

## Board
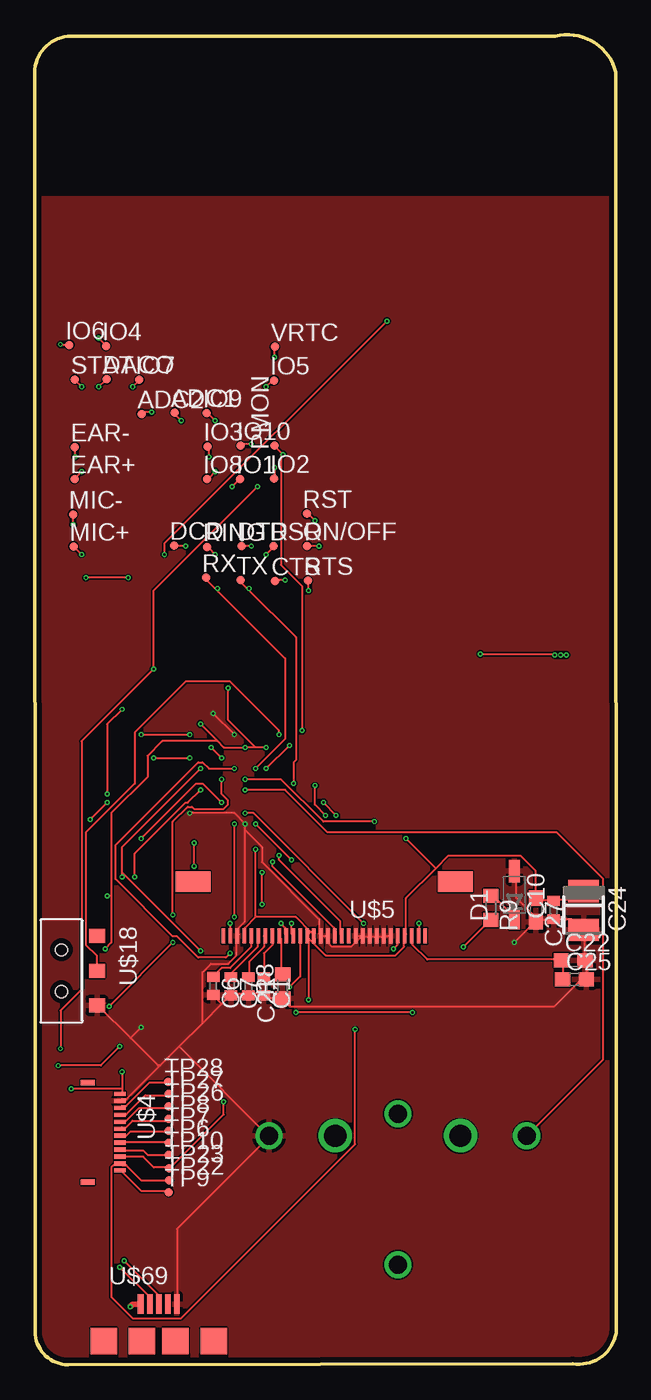
[diagram p6: board, top side]
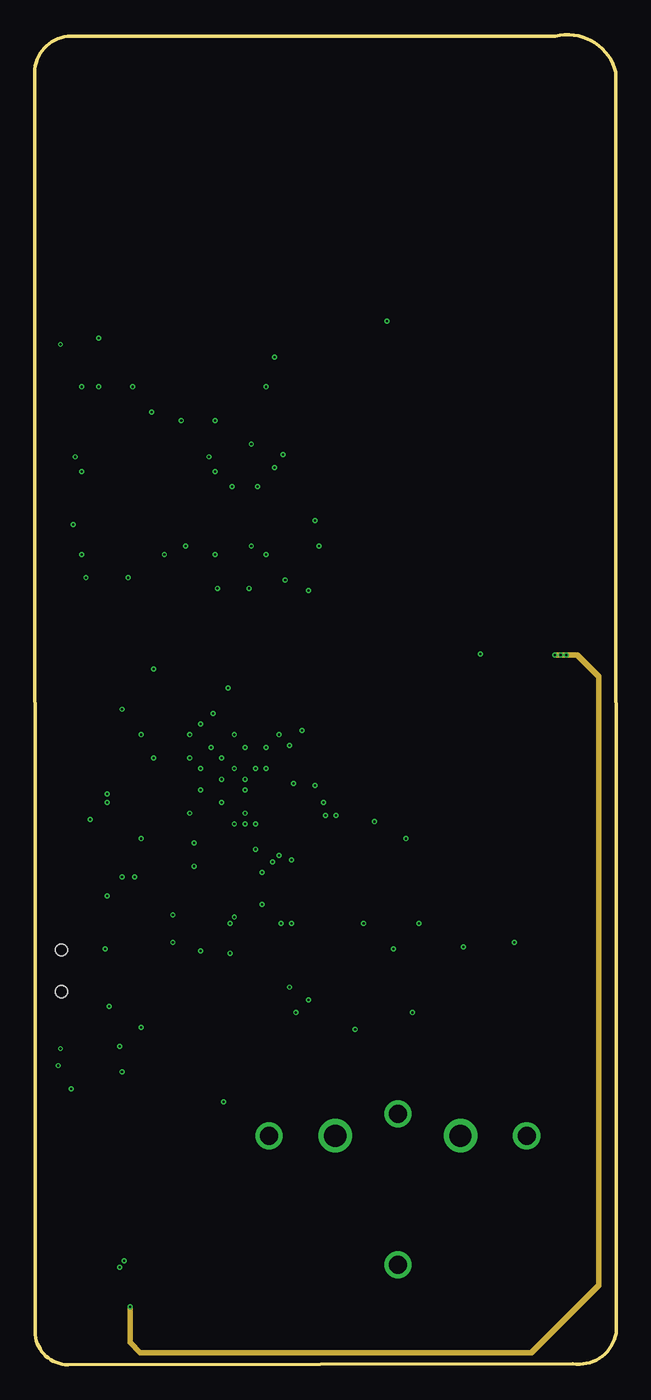
[diagram p7: board, inner layer Route2]
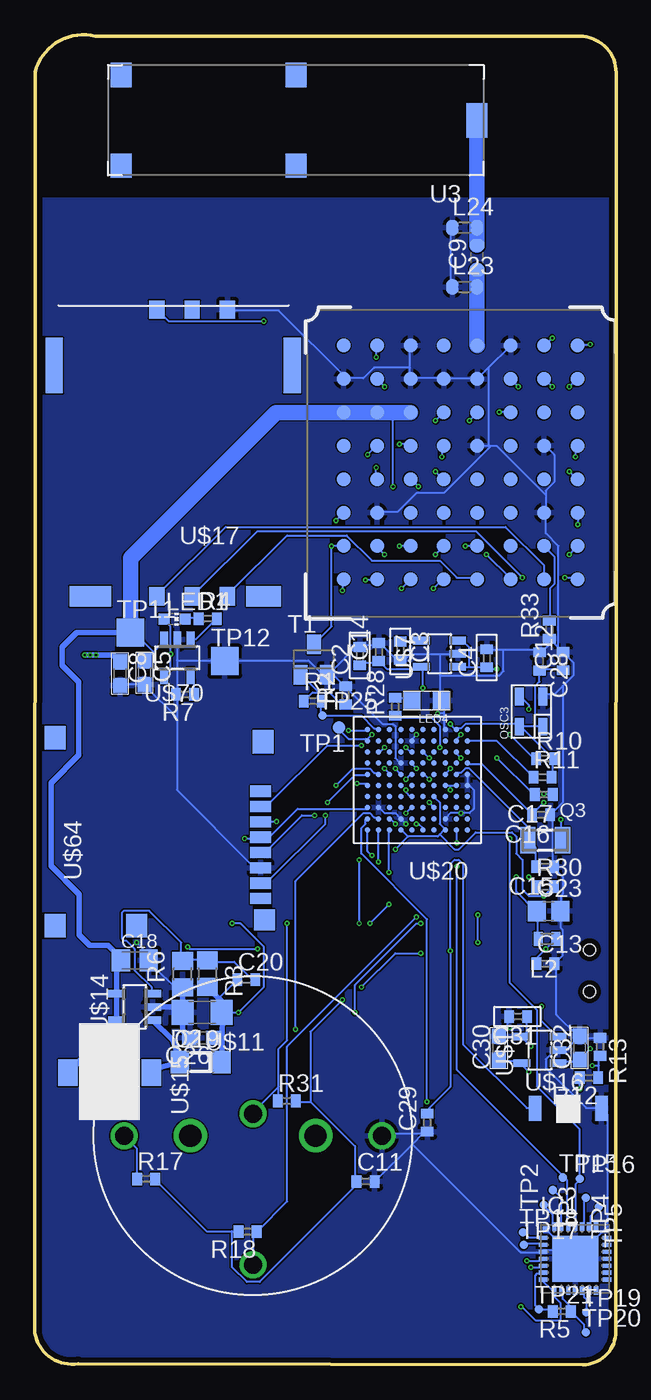
[diagram p8: board, bottom side, seen from below]

Size 41.78 x 95.55 mm. Coordinates in mm from the lower left corner, seen from the top.
Outline: 41.76,92.86 41.78,2.27 arc-90 38.66,0.08 2.4,0 arc-90 0.02,2.38 0,92.84 arc-90 2.6,95.44 37.43,95.44 arc-90 41.76,92.86
Copper layers (1*2+15*16): Top 0.035mm / dielectric 0.5mm / Route2 0.035mm / dielectric 0.48mm / Route15 0.035mm / dielectric 0.5mm / Bottom 0.035mm
Design rules "default *": minimum track width 6mil, minimum drill 6mil, track to track 4mil, track to pad 4mil, pad to pad 4mil, via to via 4mil, smd to smd 4mil, copper to edge 15mil, drill to drill 6mil, minimum pad ring 4mil, minimum via ring 4mil, stop-mask expansion 4mil, vias tented up to drill 0mil, thermal gap 10mil

### Footprints (pad centres in the part's own frame; a part is rotated, then mirrored left to right if it is on the bottom)
TP06R = smd 0.6 x 0.6: TP 0,0
C0402 = smd 0.7 x 0.9: 1 -0.65,0; 2 0.65,0
C0603 = smd 1.1 x 1: 1 -0.85,0; 2 0.85,0
C0603-ROUND = smd 0.898 x 1.1: 1 -0.889,0; 2 0.889,0
0402 = smd 0.7 x 0.9: 1 -0.65,0; 2 0.65,0
C0805K = smd 1.3 x 1.6: 1 -1,0; 2 1,0
C1206 = smd 1.6 x 1.8: 1 -1.4,0; 2 1.4,0
0805 = smd 1.3 x 1.5: 1 -0.85,0; 2 0.85,0
C106B = smd 1.6 x 2.2: 1 -1.4,0; 2 1.4,0
SOD123 = smd 1.6 x 0.8: 1 -1.7,0; 2 1.7,0
SOD-123 = smd 1.3 x 1.6: 1 -1.5,0; 2 1.5,0
MLP28 = smd 0.6 x 0.3: 1 -2.3,1.5; 2 -2.3,1; 3 -2.3,0.5; 4 -2.3,0; 5 -2.3,-0.5; 6 -2.3,-1; 7 -2.3,-1.5; 15 2.3,-1.5; 16 2.3,-1; 17 2.3,-0.5; 18 2.3,0; 19 2.3,0.5; 20 2.3,1; 21 2.3,1.5 | smd 0.3 x 0.6: 8 -1.5,-2.3; 9 -1,-2.3; 10 -0.5,-2.3; 11 0,-2.3; 12 0.5,-2.3; 13 1,-2.3; 14 1.5,-2.3; 22 1.5,2.3; 23 1,2.3; 24 0.5,2.3; 25 0,2.3; 26 -0.5,2.3; 27 -1,2.3; 28 -1.5,2.3 | smd 3.3 x 3.3: EXP 0,0 | smd 0.435 x 0.435: M -2.103,2.103
L0603 = smd 0.635 x 1.016: P$1 -0.635,0; P$2 0.635,0
R0603-ROUND = smd 0.898 x 1.1: 1 -0.889,0; 2 0.889,0
CHIP-LED0603 = smd 0.8 x 0.8: A 0,-0.75; C 0,0.75
LED_0805 = smd 1.2 x 1.25: A 1.05,0; K -1.05,0
OSC3.2X.2.5 = smd 1.27 x 0.635: P$1 -1.092,-0.838; P$2 1.092,-0.838; P$3 1.092,0.838; P$4 -1.092,0.838
FC135 = smd 1.1 x 1.9: X1 -1.25,0; X2 1.25,0
R0402 = smd 0.7 x 0.9: 1 -0.65,0; 2 0.65,0
R0805 = smd 1.3 x 1.5: 1 -0.95,0; 2 0.95,0
R0603 = smd 1 x 1.1: 1 -0.85,0; 2 0.85,0
SOT23 = smd 1 x 1.4: 1 -0.95,-1.1; 2 0.95,-1.1; 3 0,1.1
TP09R = smd 0.9 x 0.9: TP 0,0
TP20SQ = smd 2 x 2: TP 0,0
CALVUS_5BAND_SMD_A10340_0MM_EXCLUSION = smd 2.5 x 1.5: FEED 3.95,0.5 | smd 1.75 x 1.5: FIXINGPOINT$1 0.7,26.05; FIXINGPOINT$2 7.22,26.05; FIXINGPOINT$3 0.7,13.49; FIXINGPOINT$4 7.22,13.49
SOT23-5 = smd 0.55 x 1.2: 1 -0.95,-1.3; 2 0,-1.3; 3 0.95,-1.3; 4 0.95,1.3; 5 -0.95,1.3
GE865 = smd 1 x 1: A1 -8.4,8.4; A2 -8.4,6; A3 -8.4,3.6; A4 -8.4,1.2; A5 -8.4,-1.2; A6 -8.4,-3.6; A7 -8.4,-6; A8 -8.4,-8.4; B1 -6,8.4; B2 -6,6; B3 -6,3.6; B4 -6,1.2; B5 -6,-1.2; B6 -6,-3.6; B7 -6,-6; B8 -6,-8.4; C1 -3.6,8.4; C2 -3.6,6; C3 -3.6,3.6; C4 -3.6,1.2; C5 -3.6,-1.2; C6 -3.6,-3.6; C7 -3.6,-6; C8 -3.6,-8.4; D1 -1.2,8.4; D2 -1.2,6; D3 -1.2,3.6; D4 -1.2,1.2; D5 -1.2,-1.2; D6 -1.2,-3.6; D7 -1.2,-6; D8 -1.2,-8.4; E1 1.2,8.4; E2 1.2,6; E3 1.2,3.6; E4 1.2,1.2; E5 1.2,-1.2; E6 1.2,-3.6; E7 1.2,-6; E8 1.2,-8.4; F1 3.6,8.4; F2 3.6,6; F3 3.6,3.6; F4 3.6,1.2; F5 3.6,-1.2; F6 3.6,-3.6; F7 3.6,-6; F8 3.6,-8.4; G1 6,8.4; G2 6,6; G3 6,3.6; G4 6,1.2; G5 6,-1.2; G6 6,-3.6; G7 6,-6; G8 6,-8.4; H1 8.4,8.4; H2 8.4,6; H3 8.4,3.6; H4 8.4,1.2; H5 8.4,-1.2; H6 8.4,-3.6; H7 8.4,-6; H8 8.4,-8.4
20488-012E-01 = smd 0.3 x 0.8: 1 5.5,0; 2 5,0; 3 4.5,0; 4 4,0; 5 3.5,0; 6 3,0; 7 2.5,0; 8 2,0; 9 1.5,0; 10 1,0; 11 0.5,0; 12 0,0 | smd 0.4 x 1: P$13 -0.825,-2.3; P$14 6.325,-2.3
30ZIF = smd 0.25 x 1.1: 1 -7.253,0; 2 -6.758,0; 3 -6.26,0; 4 -5.753,0; 5 -5.254,0; 6 -4.756,0; 7 -4.258,0; 8 -3.751,0; 9 -3.252,0; 10 -2.754,0; 11 -2.256,0; 12 -1.749,0; 13 -1.25,0; 14 -0.752,0; 15 -0.254,0; 16 0.254,0; 17 0.752,0; 18 1.25,0; 19 1.749,0; 20 2.256,0; 21 2.754,0; 22 3.252,0; 23 3.751,0; 24 4.258,0; 25 4.756,0; 26 5.254,0; 27 5.753,0; 28 6.26,0; 29 6.758,0; 30 7.253,0 | smd 2.5 x 1.5: P$31 -9.418,-3.899; P$32 9.436,-3.899
TSWA-3N-CB11_LFS = drill 1.6: 1 4.5,0; 2 -4.5,0 | drill 1.3: A -9.26,0; B 0,-9.26; COM 9.26,0; NO 0,1.57
SOT23-5L = smd 0.55 x 1.2: 1 -0.95,-1.3; 2 0,-1.3; 3 0.95,-1.3; 4 0.95,1.3; 5 -0.95,1.3
INDUCTORSMD1 = smd 1.9 x 1.4: 1 0,3.001; 2 0,-3.001
2.9X3.9X2.0 = smd 0.9 x 1.8: 1 -2.394,0.008; 2 2.379,0.032
FMS006-5000-0 = smd 1.1 x 1.3: C1 7.68,0; C2 5.14,0; C3 2.6,0; C5 2.6,-20.6; C6 5.14,-20.6; C7 7.68,-20.6 | smd 2.5 x 1.5: P$1 0,0 | smd 3 x 1.5: P$2 12.45,0 | smd 1.25 x 4: P$3 -2.05,-16.58; P$4 15.05,-16.58
AYZ0102 = smd 1 x 1.15: 1 -2.5,2.573; 2 0,2.573; 3 2.5,2.573 | hole 0.85: 1.5,0; -1.5,0
TFBGA100 = smd 0.4 x 0.4: A1 0,0; A2 0.8,0; A3 1.6,0; A4 2.4,0; A5 3.2,0; A6 4,0; A7 4.8,0; A8 5.6,0; A9 6.4,0; A10 7.2,0; B1 0,-0.806; B2 0.8,-0.806; B3 1.6,-0.806; B4 2.4,-0.806; B5 3.2,-0.806; B6 4,-0.806; B7 4.8,-0.806; B8 5.6,-0.806; B9 6.4,-0.806; B10 7.2,-0.806; C1 0,-1.608; C2 0.8,-1.608; C3 1.6,-1.608; C4 2.4,-1.608; C5 3.2,-1.608; C6 4,-1.608; C7 4.8,-1.608; C8 5.6,-1.608; C9 6.4,-1.608; C10 7.2,-1.608; D1 0,-2.402; D2 0.8,-2.402; D3 1.6,-2.402; D4 2.4,-2.402; D5 3.2,-2.402; D6 4,-2.402; D7 4.8,-2.402; D8 5.6,-2.402; D9 6.4,-2.402; D10 7.2,-2.402; E1 0,-3.207; E2 0.8,-3.207; E3 1.6,-3.207; E4 2.4,-3.207; E5 3.2,-3.207; E6 4,-3.207; E7 4.8,-3.207; E8 5.6,-3.207; E9 6.4,-3.207; E10 7.2,-3.207; F1 0,-4.001; F2 0.8,-4.001; F3 1.6,-4.001; F4 2.4,-4.001; F5 3.2,-4.001; F6 4,-4.001; F7 4.8,-4.001; F8 5.6,-4.001; F9 6.4,-4.001; F10 7.2,-4.001; G1 0,-4.807; G2 0.8,-4.807; G3 1.6,-4.807; G4 2.4,-4.807; G5 3.2,-4.807; G6 4,-4.807; G7 4.8,-4.807; G8 5.6,-4.807; G9 6.4,-4.807; G10 7.2,-4.807; H1 0,-5.609; H2 0.8,-5.609; H3 1.6,-5.609; H4 2.4,-5.609; H5 3.2,-5.609; H6 4,-5.609; H7 4.8,-5.609; H8 5.6,-5.609; H9 6.4,-5.609; H10 7.2,-5.609; J1 0,-6.403; J2 0.8,-6.403; J3 1.6,-6.403; J4 2.4,-6.403; J5 3.2,-6.403; J6 4,-6.403; J7 4.8,-6.403; J8 5.6,-6.403; J9 6.4,-6.403; J10 7.2,-6.403; K1 0,-7.208; K2 0.8,-7.208; K3 1.6,-7.208; K4 2.4,-7.208; K5 3.2,-7.208; K6 4,-7.208; K7 4.8,-7.208; K8 5.6,-7.208; K9 6.4,-7.208; K10 7.2,-7.208
502774-0891 = smd 0.8 x 1.5: 1 2.9,-15.61; 2 1.8,-15.61; 3 0.7,-15.61; 4 -0.4,-15.61; 5 -1.5,-15.61; 6 -2.6,-15.61; 7 -3.7,-15.61; 8 -4.8,-15.61 | smd 1.7 x 1.5: P$1 -6.75,-0.85; P$2 6.75,-0.85; P$3 -6.75,-6.7; P$12 6.45,-15.79 | smd 1.5 x 1.5: P$13 -6.346,-15.898
MICRO_USB = smd 0.4 x 1.4: 1 -1.3,0; 2 -0.65,0; 3 0,0; 4 0.65,0; 5 1.3,0 | smd 1.9 x 1.9: P$6 3.95,-2.65; P$7 -3.95,-2.65; P$8 -1.2,-2.65; P$9 1.2,-2.65

### Placement (x,y rotation side)
ADC1  10.06,68.41 0 top
ADC2  7.67,68.3 0 top
C1  16.45,27.19 270 top
C2  18.41,50.91 90 bottom
C3  15.5,51.3 270 bottom
C4  9.29,50.76 90 bottom
C5  33.89,49.72 270 bottom
C6  12.82,27.21 270 top
C7  14.11,27.19 270 top
C8  35.65,49.65 270 bottom
C9  9.99,79.54 90 bottom
C10  37.29,32.66 90 top
C11  18,13.17 0 bottom
C12  3.8,50.55 90 bottom
C13  5.08,28.82 0 bottom
C14  17.05,51.2 90 bottom
C15  5.1,35.78 180 bottom
C16  5.38,39.51 180 bottom
C17  5.19,40.97 180 bottom
C18  34.59,29.05 0 bottom
C19  29.75,25.31 180 bottom
C20  26.57,27.67 0 bottom
C21  15.36,27.19 270 top
C22  38.7,29.05 0 top
C23  4.85,32.58 0 bottom
C24  39.45,32.63 270 top
C25  38.79,27.69 0 top
C26  29.78,23.49 180 bottom
C27  36.02,32.68 270 top
C28  5.5,50.53 270 bottom
C29  13.57,17.39 90 bottom
C30  8.42,22.74 90 bottom
C31  7.04,25.02 180 bottom
C32  2.61,22.76 90 bottom
CTS  17.28,56.3 0 top
D1  34.48,33.77 90 top
D2  29.85,21.75 0 bottom
DACO  5.18,70.81 0 top
DCD  10,58.86 0 top
DSR  17.18,58.81 0 top
DTR  14.86,58.83 0 top
EAR+  2.86,63.64 0 top
EAR-  2.88,65.93 0 top
IC1  2.94,7.62 0 bottom
IO1  14.76,63.63 0 top
IO2  17.19,63.67 0 top
IO3  12.41,65.98 0 top
IO4  5.13,73.19 0 top
IO5  17.2,70.72 0 top
IO6  2.48,73.25 0 top
IO7  7.51,70.76 0 top
IO8  12.38,63.63 0 top
IO9  12.36,68.37 0 top
IO10  14.8,66.03 0 top
L2  4.96,30.6 180 bottom
L23  10.88,77.43 0 bottom
L24  10.88,81.68 0 bottom
LED1  31.73,53.56 270 bottom
LED4  13.61,47.71 180 bottom
MIC+  2.79,58.78 0 top
MIC-  2.75,61.09 0 top
ON/OFF  19.58,58.83 0 top
OSC3  6.1,46.92 90 bottom
PMON  17.23,66.04 90 top
Q3  5.09,37.68 180 bottom
R1  21.8,47.68 0 bottom
R2  19.44,48.09 90 bottom
R3  29.37,28.09 270 bottom
R4  29.35,53.6 0 bottom
R5  3.9,3.83 180 bottom
R6  31.16,28.07 90 bottom
R7  30.98,48.16 180 bottom
R8  17.82,27.18 90 top
R9  32.78,32.82 270 top
R10  5.1,43.55 0 bottom
R11  5.28,42.2 0 bottom
R12  1.95,20.61 180 bottom
R13  1.15,22.84 270 bottom
R17  33.78,13.35 0 bottom
R18  26.49,9.57 180 bottom
R28  15.88,47.28 90 bottom
R30  5.1,34.33 0 bottom
R31  23.66,18.96 0 bottom
R33  4.8,52.81 90 bottom
RING  12.39,58.76 0 top
RST  19.56,61.14 0 top
RTS  19.63,56.33 0 top
RX  12.32,56.54 0 top
STAT  2.88,70.78 0 top
T1  21.71,50.67 0 bottom
TP1  19.93,45.79 180 bottom
TP2  5.2,11.49 90 bottom
TP3  4.55,12.55 270 bottom
TP4  2.18,12 270 bottom
TP5  1.23,11.34 270 bottom
TP6  9.6,15.96 0 top
TP7  9.62,16.82 0 top
TP8  9.63,17.68 0 top
TP9  9.63,12.39 0 top
TP10  9.6,15.08 0 top
TP11  34.9,52.6 0 bottom
TP12  28.12,50.55 0 bottom
TP15  3.81,13.44 0 bottom
TP16  2.6,13.36 0 bottom
TP17  6.63,8.61 0 bottom
TP18  6.68,9.51 0 bottom
TP19  2.15,3.76 0 bottom
TP20  2.17,2.32 0 bottom
TP21  5.55,3.98 0 bottom
TP22  9.64,13.24 0 top
TP23  9.64,14.11 0 top
TP25  21.11,46.66 0 bottom
TP26  9.63,18.54 0 top
TP27  9.62,19.45 0 top
TP28  9.59,20.33 0 top
TX  14.78,56.37 0 top
U3  9.51,85.45 90 bottom
U$1  5.47,22.61 90 bottom
U$2  11.18,64.82 90 bottom
U$4  6.11,19.45 270 top
U$5  20.82,30.8 180 top
U$7  12.68,51.08 90 bottom
U$11  26.09,16.45 0 bottom
U$14  34.59,25.7 90 bottom
U$15  36.4,20.97 90 bottom
U$16  3.43,18.4 0 bottom
U$17  25.33,55.21 180 bottom
U$18  1.91,28.3 270 top
U$20  10.68,38.41 180 bottom
U$64  41.16,38.3 90 bottom
U$69  8.91,4.35 0 top
U$70  31.53,50.79 180 bottom
VRTC  17.27,73.13 0 top

### Tracks (layer width: path | path; a pad name or v marks a point on that pad's centre or on a via)
12MHZ  (via drill 0.15)
  Top 0.152: v5.2,41 5.2,46.02 v6.27,47.09
  Bottom 0.152: v5.2,41 4.59,41 C17.1 | v6.27,47.09 6.27,47.4 6.88,48.01 OSC3.P$3
/SS  (via drill 0.15)
  Top 0.152: v18.31,44.5 v16.63,42.82
  Bottom 0.152: v16.63,42.82 16.32,42.52 U$20.F8 | v18.31,44.5 20.74,44.5 25.01,40.23 25.47,40.23 U$64.2
ANT
  Bottom 1.1: C9.1 L23.2 9.99,73.24 U$2.H5
ANTENA
  Bottom 1.1: U3.FEED 10.01,81.7 L24.2 10,80.44 C9.2
CHG_STAT
  Bottom 0.152: R4.2 28.82,53.49 30.19,52.12 30.5,52.12 U$70.1
CS  (via drill 0.15)
  Top 0.152: v14.34,42.82 12.51,42.82 12.06,43.28 11.75,43.28 5.81,37.34 5.81,34.9 9.92,30.79 10.23,30.79 11.75,29.26 13.73,29.26 v14.04,29.57 | v18.31,27.13 19.07,27.89 19.07,30.79 U$5.19
  Bottom 0.152: v14.34,42.82 14.65,43.13 U$20.G6 | v14.04,29.57 15.87,29.57 v18.31,27.13
D/C  (via drill 0.15)
  Top 0.152: v18.46,36.27 v15.87,38.86 | v18.46,31.7 18.46,30.94 U$5.20
  Bottom 0.152: v15.87,38.86 16.17,39.17 U$20.B8 | v18.46,31.7 v18.46,36.27
DMINUS  (via drill 0.15)
  Top 0.152: v6.11,7.01 8.25,4.88 8.25,4.42 U$69.2
  Bottom 0.152: v6.11,7.01 5.35,7.01 IC1.5
DPLUS  (via drill 0.15)
  Top 0.152: v6.42,7.47 8.86,5.03 8.86,4.42 U$69.3
  Bottom 0.152: v6.42,7.47 5.35,7.47 IC1.4
GND  (via drill 0.15)
  Top 0.152: U$69.5 10.23,4.42 10.23,9.75 16.78,16.31 U$11.COM 16.78,16.46 10.38,22.86 | 35.98,31.85 35.98,32.16 34.61,33.53 34.61,35.36 D1.2 | 35.98,31.85 v34.46,30.33 | 35.98,31.85 C27.2 36.14,31.85 36.29,32 37.2,32 C10.1 37.36,32 38.57,32 39.34,31.24 C24.2 39.49,31.09 39.49,29.11 C22.2 39.64,28.96 39.64,27.74 C25.2 39.64,27.58 39.18,27.58 37.36,25.76 18.31,25.76 17.85,26.21 R8.1 17.7,26.36 16.63,26.36 16.48,26.52 C1.2 16.32,26.67 15.41,26.67 C21.2 15.26,26.67 14.19,26.67 C7.2 14.04,26.52 13.43,25.91 | 21.05,30.79 20.59,30.79 U$5.16 20.44,30.94 20.44,32 16.32,36.12 16.32,37.19 15.11,38.41 | U$5.6 25.47,30.79 25.16,30.79 U$5.7 25.01,30.79 24.55,30.79 | 23.49,30.79 23.18,30.79 U$5.11 | 24.1,30.79 23.64,30.79 U$5.10 23.49,30.79 | 24.1,30.79 24.55,30.79 | 24.1,30.79 U$5.9 | 24.55,30.79 U$5.8 | 21.05,30.79 21.05,30.33 21.35,30.02 22.73,30.02 23.49,30.79 | 21.05,30.79 U$5.15 | 13.43,25.91 12.06,24.54 | 12.06,24.54 10.38,22.86 | 10.38,22.86 9.01,21.49 | 9.01,21.49 6.57,19.05 6.27,19.05 U$4.11 | 13.43,25.91 12.82,26.52 C6.2 | 12.06,24.54 12.06,28.19 12.67,28.8 13.89,28.8 14.5,29.41 14.5,30.79 U$5.28 14.65,30.94 14.65,31.39 15.11,31.85 15.11,38.41 | 6.88,23.47 8.86,21.49 9.01,21.49 | 6.88,23.47 4.59,25.76 U$18.3 | 15.11,38.41 v15.11,38.86 14.34,39.62 v11.14,39.62 | 6.88,23.47 v7.64,24.23 | v12.82,46.79 v14.34,45.26
  Bottom 0.152: 5.35,8.23 IC1.3 | 5.05,9.75 IC1.M 4.89,9.6 3.52,8.23 | 2.91,7.62 3.52,8.23 | 3.52,8.23 5.2,8.23 IC1.3 | 3.52,8.23 IC1.EXP | 3.07,7.62 IC1.EXP | 13.89,16.61 16.63,16.61 16.78,16.46 U$11.COM | 13.89,16.61 13.58,16.61 C29.1 13.89,16.61 | 13.89,16.61 14.65,15.85 | 14.65,15.85 17.24,13.26 C11.2 | 14.65,15.85 6.88,8.08 5.35,8.08 IC1.3 | R6.1 31.26,26.67 33.55,28.96 C18.2 33.7,29.11 33.7,29.57 v34.46,30.33 | U$20.F1 10.69,42.37 10.69,41.76 U$20.E1 10.53,41.6 10.23,41.3 10.23,39.93 10.53,39.62 v11.14,39.62 11.9,39.62 12.21,39.32 U$20.B3 | 7.79,24.23 7.79,24.99 C31.2 | 7.79,24.23 8.4,23.62 C30.2 | U$20.C9 16.93,39.93 16.63,39.62 15.87,39.62 15.56,39.32 U$20.B7 15.41,39.17 v15.11,38.86 | v7.64,24.23 7.79,24.23 | 5.05,62.48 5.05,62.79 4.44,63.4 4.44,65.38 5.05,65.99 U$2.E7 | 5.05,62.48 5.05,61.27 U$2.C7 5.05,61.11 5.05,59.74 4.13,58.83 4.13,51.51 | 9.01,65.99 8.55,65.99 5.05,62.48 | 9.01,65.99 9.16,65.99 | 9.16,65.99 9.92,65.99 U$2.E5 | 9.01,65.99 12.36,62.64 14.34,62.64 15.71,61.27 17.09,61.27 U$2.C2 | 9.16,71.63 9.92,70.87 U$2.G5 10.08,70.87 12.36,70.87 U$2.G4 12.51,70.87 14.65,70.87 U$2.G3 14.8,70.87 14.8,71.63 | 9.16,71.63 7.64,73.15 U$2.H6 | 14.8,71.63 14.8,73.15 U$2.H3 | 19.37,70.87 18.15,70.87 17.39,71.63 14.8,71.63 | 19.37,70.87 19.52,70.87 U$2.G1 19.37,70.87 | 19.37,70.87 24.25,75.74 27.91,75.74 U$17.C5 | 9.16,71.63 9.16,65.99 | R13.1 1.24,23.47 2.61,23.47 C32.2 | C32.2 2.76,23.62 4.28,25.15 4.28,28.8 C13.2 4.28,28.96 3.83,29.41 3.83,31.24 3.98,31.39 3.98,32.46 C23.2 3.98,32.61 3.98,33.68 3.83,33.83 3.83,35.05 4.44,35.66 C15.1 4.59,35.81 4.59,39.47 C16.1 4.59,39.62 3.83,40.39 3.83,48.77
  Bottom 0.152: C32.2 2.76,23.47 3.52,22.71 4.13,22.71 U$1.2 4.28,22.71 5.05,21.95 5.05,21.34 2.15,18.44 1.08,18.44 U$16.2 0.93,18.29 0.63,17.98 0.63,9.91 2.91,7.62 | U$20.G7 15.56,43.28 15.87,43.59 15.87,45.87 16.02,46.02 16.78,46.02 19.37,48.62 R2.2 19.52,48.77 20.29,49.53 | 20.29,49.53 20.74,49.53 T1.2 | 4.59,51.97 4.74,52.12 R33.1 4.59,51.97 | 4.59,51.97 4.13,51.51 | 4.13,51.51 3.83,51.21 C12.2 | 4.59,51.97 5.2,51.36 | 5.2,51.36 5.35,51.21 C28.1 5.2,51.36 | 5.2,51.36 8.09,51.36 | 8.09,51.36 9.16,51.36 C4.2 | 3.83,48.77 3.07,49.53 3.07,50.44 3.68,51.05 C12.2 | 3.83,48.77 4.44,48.16 5.2,48.16 OSC3.P$2 | 12.36,46.79 12.36,47.55 12.51,47.7 LED4.K 12.67,47.85 12.67,49.53 | 12.36,46.79 12.36,45.72 U$20.K3 | v14.34,45.26 14.65,44.96 U$20.J6 | 12.36,46.79 v12.82,46.79 | 16.78,51.66 16.93,51.82 C14.2 16.78,51.66 | 16.78,51.66 15.87,50.75 15.56,50.75 C3.2 15.41,50.75 15.11,50.75 14.8,51.05 12.67,51.05 | 16.78,51.66 18.31,51.66 C2.2 18.46,51.51 18.76,51.51 20.29,49.99 20.29,49.53 | 12.67,51.05 11.45,51.05 U$7.2 | 12.67,51.05 12.67,49.53 | 8.09,51.36 8.09,49.84 8.4,49.53 12.67,49.53 | 20.29,49.53 T1.2 | C8.2 35.53,48.92 34,48.92 C5.2 33.85,48.77 31.56,46.48 | 31.56,50.6 31.56,51.97 U$70.2 | 31.56,50.6 31.56,48.16 R7.2 31.56,48.01 31.56,46.48 | 31.56,46.48 31.56,41.3 26.08,35.81 25.62,35.81 U$64.6 | 31.56,50.6 28.21,50.6 TP12.TP 28.06,50.6 22.12,50.6 21.2,49.68 20.9,49.68 T1.2 | 4.13,51.51 C12.2 | 2.91,7.62 IC1.EXP | 11.9,77.57 11.9,81.53 L24.1
  Bottom 0.381: U$14.2 31.54,25.7 C19.2 | R6.1 C19.2 | C19.2 31.15,24.01 C26.2
  pour Bottom: -0.59,83.67 48.48,83.67 48.48,-4.81 -2.73,-4.81 -2.73,83.73
  pour Top: -0.63,83.76 45.7,83.76 45.7,-1.84 -2.89,-1.84 -3.01,83.67
GPRS_ON_OFF  (via drill 0.15)
  Top 0.152: v20.44,58.83 19.68,58.83 ON/OFF.TP
  Bottom 0.152: U$2.B1 19.68,58.83 v20.44,58.83 20.44,53.03 21.66,51.82 T1.3
GPRS_PWR_TOGGLE
  Bottom 0.152: U$20.K9 17.09,45.72 17.39,45.72 18.31,46.63 21.05,46.63 TP25.TP 21.2,46.79 21.2,47.55 R1.2
GPRS_RX  (via drill 0.15)
  Top 0.152: v15.87,42.82 18,44.96 18,50.75 12.97,55.78 | 12.97,55.78 12.36,56.39 RX.TP | 12.97,55.78 v13.12,55.78
  Bottom 0.152: v15.87,42.82 15.56,42.52 U$20.F7 | v13.12,55.78 12.51,56.39 U$2.A4
GPRS_TX  (via drill 0.15)
  Top 0.152: v18.61,41.76 18.61,43.28 18.76,43.43 18.76,52.27 15.26,55.78 | 15.26,55.78 14.8,56.24 TX.TP | 15.26,55.78 v15.41,55.78
  Bottom 0.152: v18.61,41.76 18,41.76 U$20.E10 | v15.41,55.78 14.8,56.39 U$2.A3
GPS_RESET#
  Top 0.152: TP6.TP 9.47,16 6.27,16 U$4.5
GPS_RX  (via drill 0.15)
  Top 0.152: v23.03,24.08 23.03,15.85 10.53,3.35 7.03,3.35 5.5,4.88 5.5,14.17 5.66,14.33 6.11,14.33 U$4.2 6.27,14.33 6.57,14.33 7.64,13.26 9.62,13.26 TP22.TP
  Bottom 0.152: v23.03,24.08 23.03,34.75 18.15,39.62 17.7,39.62 17.39,39.32 17.09,39.32 U$20.B9
GPS_TX  (via drill 0.15)
  Top 0.152: v13.58,18.9 13.58,17.98 9.77,14.17 TP23.TP 9.62,14.17 8.55,14.17 7.79,14.94 6.27,14.94 U$4.3
  Bottom 0.152: v13.58,18.9 13.58,32 18.31,36.73 18.31,38.56 18,38.86 18,39.17 U$20.B10
GPS_WAKEUP
  Top 0.152: TP7.TP 9.62,16.76 6.88,16.76 6.57,16.46 6.27,16.46 U$4.6
GSP_ON_OFF
  Top 0.152: TP8.TP 9.62,17.53 7.03,17.53 6.57,17.07 6.27,17.07 U$4.7
IC6_RTC1
  Bottom 0.152: U$20.F2 11.45,42.52 11.14,42.52 10.84,42.82 10.53,42.82 6.42,38.71 6.42,37.8 Q3.X2 6.27,37.64 5.81,37.19 5.81,35.81 C15.2
IC6_RTC2  (via drill 0.15)
  Top 0.152: v5.2,40.39 v3.98,39.17
  Bottom 0.152: U$20.G1 10.53,43.13 9.62,43.13 6.11,39.62 C16.2 5.96,39.62 v5.2,40.39 | v3.98,39.17 3.98,37.8 Q3.X1
IC6_XTAL1  (via drill 0.15)
  Top 0.152: v8.55,43.59 v11.14,43.59
  Bottom 0.152: v11.14,43.59 11.45,43.89 U$20.H2 | v8.55,43.59 5.96,41 C17.2
IREF
  Top 0.152: R8.2 17.7,28.04 17.7,30.63 17.54,30.79 U$5.22
LCD_SCLK  (via drill 0.15)
  Top 0.152: v17.09,36.12 17.09,35.81 21.51,31.39 21.51,30.94 U$5.14
  Bottom 0.152: v17.09,36.12 U$20.A9
LCD_SDIN  (via drill 0.15)
  Top 0.152: v17.54,36.58 17.54,36.27 21.96,31.85 21.96,30.94 U$5.13
  Bottom 0.152: v17.54,36.58 17.85,36.88 17.85,38.41 U$20.A10
LED-3  (via drill 0.15)
  Top 0.152: v12.67,44.35 v13.43,43.59
  Bottom 0.152: v13.43,43.59 13.73,43.89 U$20.H5 | v12.67,44.35 12.67,45.87 13.28,46.48 15.87,46.48 R28.1
MISO  (via drill 0.15)
  Top 0.152: v20.13,41.6 20.13,40.23 v20.9,39.47
  Bottom 0.152: v20.13,41.6 18.92,42.82 17.7,42.82 17.39,42.52 17.09,42.52 U$20.F9 | v20.9,39.47 20.9,38.86 25.01,34.75 25.47,34.75 U$64.7
MOSI  (via drill 0.15)
  Top 0.152: v15.11,42.06 17.7,42.06 20.74,39.01 v24.4,39.01
  Bottom 0.152: v15.11,42.06 14.8,42.37 U$20.F6 | v24.4,39.01 25.47,39.01 U$64.3
N$1
  Bottom 0.152: TP20.TP 2.3,2.44 2.3,2.9 3.22,3.81 R5.1 3.37,3.96 3.37,4.27 3.83,4.72 3.83,5.18 IC1.9
N$2
  Bottom 0.152: C3.1 15.41,51.97 14.04,51.97 U$7.4
N$3
  Bottom 0.152: C20.2 25.93,27.74 26.23,27.74 27.45,28.96 29.28,28.96 R3.1 29.43,29.11 31.11,29.11 R6.2 31.26,29.11 31.26,30.33 33.55,32.61 35.37,32.61 35.53,32.46 35.53,30.63 35.37,30.48 35.22,30.48 34.61,29.87 34.61,28.35 33.39,27.13 33.39,26.67 U$14.3
N$4
  Bottom 0.152: R33.2 4.74,53.49 4.74,55.78 4.44,56.08 4.44,58.06 5.05,58.67 U$2.B7
N$5
  Top 0.152: R9.1 32.78,33.53 33.09,33.53 34.46,32.16 D1.1
N$7
  Bottom 0.152: 21.35,48.31 21.81,48.31 22.42,47.7 R1.1 | 21.35,48.31 20.59,48.31 19.83,47.55 19.52,47.55 R2.1 | 21.35,48.31 22.57,49.53 T1.1
N$8
  Bottom 0.152: IC1.24 2.3,10.06 2.3,11.89 TP4.TP
N$9
  Bottom 0.381: U$15.2 33.4,21.19 D2.1 31.84,23.3 U$14.1
N$10  (via drill 0.15)
  Top 0.152: v20.13,60.66 19.68,61.11 RST.TP
  Bottom 0.152: v20.13,60.66 19.68,61.11 U$2.C1
N$11
  Bottom 0.152: IC1.23 1.85,10.06 1.85,10.67 1.24,11.28 TP5.TP
N$12  (via drill 0.15)
  Top 0.152: v17.24,72.39 17.24,73 VRTC.TP
  Bottom 0.152: v17.24,72.39 17.24,73.15 U$2.H2
N$13
  Bottom 0.152: IC1.27 3.98,10.06 3.98,12.04 4.44,12.5 TP3.TP
N$14  (via drill 0.15)
  Top 0.152: v3.37,70.26 2.91,70.71 STAT.TP
  Bottom 0.152: v3.37,70.26 2.91,70.71 U$2.G8
N$15  (via drill 0.15)
  Top 0.152: v2.91,65.23 2.91,65.84 EAR-.TP
  Bottom 0.152: v2.91,65.23 2.91,65.99 U$2.E8
N$16
  Top 0.152: TP9.TP 9.62,12.5 7.64,12.5 6.27,13.87 U$4.1
N$17  (via drill 0.15)
  Top 0.152: v3.37,64.16 2.91,63.7 EAR+.TP
  Bottom 0.152: v3.37,64.16 2.91,63.7 U$2.D8
N$18
  Bottom 0.152: R28.2 15.87,47.85 14.8,47.85 LED4.A
N$19  (via drill 0.15)
  Top 0.152: v11.9,41.3 10.99,40.39 10.84,40.39 7.18,36.73 v7.18,35.05
  Bottom 0.152: 11.9,41.6 12.21,41.6 U$20.E3 | 11.9,41.6 11.6,41.6 U$20.E2 | v11.9,41.3 11.9,41.6 | v7.18,35.05 7.18,33.98 5.81,32.61 C23.1 5.66,32.46 5.66,30.63 L2.P$2
N$20  (via drill 0.15)
  Top 0.152: v3.37,58.22 2.91,58.67 MIC+.TP
  Bottom 0.152: v3.37,58.22 2.91,58.67 U$2.B8
N$21  (via drill 0.15)
  Top 0.152: v2.76,60.35 2.76,60.96 MIC-.TP
  Bottom 0.152: v2.76,60.35 2.76,61.11 U$2.C8
N$22
  Top 0.152: TP10.TP 9.47,15.09 8.09,15.09 7.79,15.39 6.27,15.39 U$4.4
N$23  (via drill 0.15)
  Top 0.152: v7.03,70.26 7.49,70.71 IO7.TP
  Bottom 0.152: v7.03,70.26 7.49,70.71 U$2.G6
N$24  (via drill 0.15)
  Top 0.152: v1.85,73.3 2.46,73.3 IO6.TP
  Bottom 0.152: v1.85,73.3 2.76,73.3 U$2.H8
N$25  (via drill 0.15)
  Top 0.152: v16.63,70.26 17.09,70.71 IO5.TP
  Bottom 0.152: v16.63,70.26 17.09,70.71 U$2.G2
N$26  (via drill 0.15)
  Top 0.152: v12.97,64.16 12.51,63.7 IO8.TP
  Bottom 0.152: v12.97,64.16 12.51,63.7 U$2.D4
N$27  (via drill 0.15)
  Top 0.152: v12.97,67.82 12.51,68.28 IO9.TP
  Bottom 0.152: v12.97,67.82 12.51,68.28 U$2.F4
N$28  (via drill 0.15)
  Top 0.152: v15.56,58.83 14.95,58.83 DTR.TP
  Bottom 0.152: v15.56,58.83 14.8,58.83 U$2.B3
N$29  (via drill 0.15)
  Top 0.152: v12.97,58.22 12.51,58.67 RING.TP
  Bottom 0.152: v12.97,58.22 12.51,58.67 U$2.B4
N$30  (via drill 0.15)
  Top 0.152: v16.63,58.22 17.09,58.67 DSR.TP
  Bottom 0.152: v16.63,58.22 17.09,58.67 U$2.B2
N$31  (via drill 0.15)
  Top 0.152: v10.84,58.83 10.08,58.83 DCD.TP
  Bottom 0.152: v10.84,58.83 10.08,58.83 U$2.B5
N$32  (via drill 0.15)
  Top 0.152: v18,56.39 17.39,56.39 CTS.TP
  Bottom 0.152: v18,56.39 17.24,56.39 U$2.A2
N$33  (via drill 0.15)
  Top 0.152: v19.68,55.63 19.68,56.24 RTS.TP
  Bottom 0.152: v19.68,55.63 19.68,56.39 U$2.A1
N$34
  Bottom 0.152: TP17.TP 6.57,8.69 5.35,8.69 IC1.2
N$35
  Bottom 0.152: IC1.1 5.35,9.14 6.27,9.14 6.57,9.45 TP18.TP
N$36
  Bottom 0.152: TP19.TP 2.15,3.81 2.15,4.72 2.3,4.88 2.3,5.18 IC1.12
N$37
  Top 0.152: TP26.TP 9.62,18.44 7.49,18.44 6.57,17.53 6.27,17.53 U$4.8
N$38
  Top 0.152: TP27.TP 9.62,19.36 7.94,19.36 6.57,17.98 6.27,17.98 U$4.9
N$39
  Top 0.152: TP28.TP 9.47,20.27 8.25,20.27 6.57,18.59 6.27,18.59 U$4.10
N$40  (via drill 0.15)
  Top 0.152: v14.19,63.09 14.65,63.55 IO1.TP
  Bottom 0.152: v14.19,63.09 14.65,63.55 U$2.D3
N$41  (via drill 0.15)
  Top 0.152: v17.24,64.47 17.24,63.7 IO2.TP
  Bottom 0.152: v17.24,64.47 17.24,63.7 U$2.D2
N$42  (via drill 0.15)
  Top 0.152: v12.51,65.23 12.51,65.84 IO3.TP
  Bottom 0.152: v12.51,65.23 12.51,65.99 U$2.E4
N$43  (via drill 0.15)
  Top 0.152: v4.59,73.76 5.05,73.3 IO4.TP
  Bottom 0.152: v4.59,73.76 5.05,73.3 U$2.H7
N$44  (via drill 0.15)
  Top 0.152: v4.59,70.26 5.05,70.71 DACO.TP
  Bottom 0.152: v4.59,70.26 5.05,70.71 U$2.G7
N$45  (via drill 0.15)
  Top 0.152: v10.53,67.82 10.08,68.28 ADC1.TP
  Bottom 0.152: v10.53,67.82 10.08,68.28 U$2.F5
N$46  (via drill 0.15)
  Top 0.152: v8.4,68.43 7.79,68.43 ADC2.TP
  Bottom 0.152: v8.4,68.43 7.64,68.43 U$2.F6
N$47  (via drill 0.15)
  Top 0.152: v15.56,66.14 14.95,66.14 IO10.TP
  Bottom 0.152: v15.56,66.14 14.8,66.14 U$2.E3
N$48
  Bottom 0.152: LED1.C 30.95,53.65 30.04,53.65 R4.1
N$49
  Bottom 0.152: R7.1 30.35,48.16 30.35,49.23 30.5,49.38 U$70.5
N$50  (via drill 0.15)
  Top 0.152: v1.69,21.49 4.74,21.49 v6.11,22.86
  Bottom 0.152: 1.24,21.49 1.24,20.73 R12.1 | 1.24,21.49 1.24,22.1 R13.2 | C31.1 6.42,24.99 6.42,23.93 6.72,23.62 U$1.4 6.72,23.47 v6.11,22.86 | v1.69,21.49 1.24,21.49
PUSH_BUTTON  (via drill 0.15)
  Top 0.152: v15.11,39.62 15.71,39.62 v23.64,31.7
  Bottom 0.152: v15.11,39.62 14.8,39.93 U$20.C6 | v23.64,31.7 23.64,23.32 24.25,22.71 24.25,19.96 | 24.25,19.96 24.25,19.05 R31.1 | 24.25,19.96 26.08,18.14 U$11.NO
PWRMON  (via drill 0.15)
  Top 0.152: v19.22,45.57 19.22,55.93 17.7,57.45 17.7,65.38 | 17.7,65.38 17.7,65.53 17.24,65.99 PMON.TP | 17.7,65.38 v17.85,65.38
  Bottom 0.152: v19.22,45.57 18,45.57 U$20.K10 | v17.85,65.38 17.24,65.99 U$2.E2
RES  (via drill 0.15)
  Top 0.152: v16.32,33.07 v16.32,35.36 | v17.7,31.7 18,31.39 18,30.94 U$5.21
  Bottom 0.152: v16.32,35.36 16.32,38.41 U$20.A8 | v17.7,31.7 v16.32,33.07
RESET
  Bottom 0.152: IC1.28 4.59,10.06 4.59,10.82 5.2,11.43 TP2.TP
ROTA  (via drill 0.15)
  Top 0.152: v15.11,41.3 18,41.3 21.05,38.25 37.51,38.25 40.86,34.9 40.86,21.95 35.37,16.46 U$11.A
  Bottom 0.152: v15.11,41.3 15.11,41.15 14.8,40.84 U$20.D6 | R17.1 34.46,13.41 34.46,15.54 35.22,16.31 U$11.A
ROTB  (via drill 0.15)
  Top 0.152: v14.34,32.16 v14.34,38.86
  Bottom 0.152: v14.34,38.86 14.19,38.86 13.89,38.56 U$20.A5 | v14.34,32.16 23.64,22.86 23.64,11.73 25.77,9.6 R18.1 25.93,9.45 26.08,9.3 26.08,7.32 U$11.B
RXD0  (via drill 0.15)
  Top 0.152: v11.45,35.81 v11.45,37.49
  Bottom 0.152: v11.45,37.49 11.45,38.41 U$20.A2 | v11.45,35.81 11.45,21.18 3.83,13.56 TP15.TP 3.68,13.41 3.52,13.26 3.52,10.06 IC1.26
SCK  (via drill 0.15)
  Top 0.152: v21.66,39.47 v20.74,40.39
  Bottom 0.152: v20.74,40.39 18.76,42.37 18,42.37 U$20.F10 | v21.66,39.47 22.57,39.47 25.16,36.88 25.47,36.88 U$64.5
SCL
  Bottom 0.152: U$20.J1 10.53,44.81 8.55,44.81 5.96,42.22 R11.1
SDA  (via drill 0.15)
  Top 0.152: v7.64,45.26 v11.14,45.26
  Bottom 0.152: v11.14,45.26 11.45,44.96 U$20.J2 | v7.64,45.26 5.81,43.43 R10.1
SIMCLK
  Bottom 0.152: U$2.A5 10.08,56.54 11.45,56.54 12.67,57.76 17.54,57.76 19.37,59.59 23.64,59.59 27.91,55.32 U$17.C3
SIMIO  (via drill 0.15)
  Top 0.152: v9.31,58.22 9.31,58.98 v25.32,74.98
  Bottom 0.152: v9.31,58.22 7.64,56.54 U$2.A6 | v25.32,74.98 32.17,74.98 32.94,75.74 U$17.C7
SIMRST  (via drill 0.15)
  Top 0.152: v6.72,56.54 v3.68,56.54
  Bottom 0.152: v3.68,56.54 2.91,56.54 U$2.A8 | v6.72,56.54 10.08,59.89 25.77,59.89 30.35,55.32 U$17.C2
SIMVCC
  Bottom 0.152: U$2.A7 5.2,56.54 5.2,57.45 7.94,60.2 28.06,60.2 32.94,55.32 U$17.C1
TGT_NRESET  (via drill 0.15)
  Top 0.152: v11.9,42.82 6.27,37.19 6.27,35.36 | v6.27,35.05 6.27,35.36 | 6.27,35.36 v11.9,29.72
  Bottom 0.152: v11.9,42.82 12.21,42.52 U$20.F3 | v6.27,35.05 5.66,34.44 R30.1 | C29.2 13.43,18.14 13.43,18.44 11.9,19.96 v11.9,29.72 11.9,35.97 11.6,36.27 11.3,36.27 10.99,35.97 10.99,23.01 6.42,18.44 5.96,18.44 U$16.1
TGT_SBL_ISP  (via drill 0.15)
  Top 0.152: v17.54,45.26 17.54,45.57 14.04,49.07 10.84,49.07 7.18,45.41 7.18,41.76 3.68,38.25 3.68,30.18 4.44,29.41 4.44,28.35 U$18.2
  Bottom 0.152: TP1.TP 19.98,45.72 19.22,44.96 18,44.96 U$20.J10 17.85,44.96 v17.54,45.26
TXD0  (via drill 0.15)
  Top 0.152: v13.43,40.39 12.06,41.76 11.6,41.76 v7.64,37.8
  Bottom 0.152: v13.43,40.39 13.12,40.08 U$20.C4 | v7.64,37.8 7.64,27.43 5.66,25.45 5.66,19.96 2.61,16.92 2.61,13.41 TP16.TP 2.61,13.26 2.91,12.95 2.91,10.06 IC1.25
USB_BUS  (via drill 0.15)
  Top 0.152: v32.02,51.05 37.36,51.05 v37.38,50.99
  Top 0.381: U$69.1 7.02,4.35 v6.84,4.17
  Route2 0.381: v38.2,50.99 v37.8,50.99 37.39,51 v37.38,50.99 37.39,50.98 38.99,50.98 40.54,49.44 40.54,5.72 35.69,0.87 7.58,0.87 6.84,1.61 v6.84,4.17
  Bottom 0.152: IC1.7 5.35,6.1 4.59,5.33 IC1.8 4.44,5.18 4.44,4.88 3.98,4.42 3.98,3.2 5.81,3.2 6.72,4.12 v6.84,4.17 | LED1.A 32.48,53.49 32.02,53.03 v32.02,51.05 32.02,49.99 32.48,49.53 U$70.4
  Bottom 0.381: v38.2,50.99 36.14,50.99 C8.1
VBATT  (via drill 0.15)
  Top 0.152: v1.85,22.71 1.85,25.45 3.37,26.98 3.37,44.81 v8.55,49.99 8.55,55.63 v16.02,63.09
  Bottom 0.152: 33.24,51.21 32.48,51.97 U$70.3 | 33.24,51.21 33.85,50.6 C5.1 | 33.24,51.21 34.46,52.43 TP11.TP | U$1.1 4.13,21.79 2.76,21.79 C32.1 2.61,21.95 v1.85,22.71 | 10.53,50.14 11.3,50.14 U$7.1 | 10.53,50.14 9.31,50.14 C4.1 9.16,49.99 v8.55,49.99 | 10.53,50.14 10.53,51.51 10.99,51.97 11.3,51.97 U$7.3 | v16.02,63.09 16.02,68.42
  Bottom 0.381: U$15.1 35.89,24.48 U$14.5 U$14.4 35.89,28.74 C18.1 35.59,29.24 36.49,30.14 37.84,30.14 38.59,30.89 38.59,33.8 40.61,35.82 40.61,41.8 38.62,43.8 38.62,49.05 39.81,50.23 39.81,51.58 38.78,52.6 TP11.TP
  Bottom 1.1: U$2.F3 16.02,68.42 U$2.F2 U$2.F1 24.44,68.42 34.9,57.95 TP11.TP
VBREF
  Top 0.152: C6.1 12.82,27.89 13.43,28.5 14.04,28.5 15.56,30.02 15.56,30.79 U$5.26
VCC  (via drill 0.15)
  Top 0.152: v16.63,44.35 15.87,44.35 | 15.87,44.35 v15.11,44.35 13.58,44.35 13.12,44.81 | v11.9,46.02 13.12,44.81 | v5.05,29.87 5.5,30.33 5.5,33.68 | 5.5,33.68 5.5,39.62 8.09,42.22 8.09,43.74 9.16,44.81 13.12,44.81 | v13.89,48.62 13.89,46.33 15.87,44.35 | 5.5,33.68 v5.2,33.68 | C24.1 39.34,33.98 38.73,33.38 37.36,33.38 C10.2 37.2,33.38 36.29,33.38 36.14,33.53 C27.1 35.98,33.68 35.98,35.51 34.92,36.58 29.74,36.58 28.82,35.66 | 15.87,32.16 15.11,31.39 15.11,30.94 U$5.27 | 15.87,32.16 18.76,32.16 19.83,31.09 | 19.83,31.09 19.98,30.94 U$5.17 | 19.83,31.09 19.68,30.94 U$5.18 | 19.68,30.63 19.52,30.79 U$5.18 | 19.68,30.63 20.9,29.41 25.93,29.41 26.54,30.02 26.54,30.79 U$5.4 26.69,30.94 26.69,33.53 28.82,35.66 | 28.82,35.66 v26.69,37.8 | 19.68,30.63 v19.68,26.21 | 19.68,30.63 U$5.18 | 15.87,32.16 v15.87,37.03
  Bottom 0.152: U$20.D4 12.97,40.69 12.67,40.39 12.67,38.86 12.36,38.56 U$20.A3 12.36,38.41 12.67,38.1 | 14.95,37.95 15.41,38.41 U$20.A7 | 14.95,37.95 12.82,37.95 12.67,38.1 | 12.67,38.1 11.6,37.03 11.3,37.03 10.08,38.25 7.49,38.25 7.18,37.95 7.18,36.73 6.72,36.27 6.72,34.14 6.27,33.68 v5.2,33.68 4.59,34.29 R30.2 | C2.1 18.31,50.29 18.15,50.44 17.09,50.44 C14.1 16.93,50.44 16.48,49.99 14.04,49.99 U$7.5 13.89,49.99 v13.89,48.62 | C13.1 5.66,28.96 5.66,29.26 v5.05,29.87 4.44,30.48 L2.P$1 | C12.1 3.83,49.99 5.35,49.99 C28.2 5.5,49.84 5.5,49.07 5.81,48.77 5.81,45.87 | R11.2 4.59,42.22 4.59,43.43 R10.2 4.59,43.59 6.88,45.87 | v15.11,44.35 14.8,44.04 U$20.H6 | v16.63,44.35 16.93,44.04 U$20.H9 | v11.9,46.02 11.6,45.72 U$20.K2 11.45,45.72 11.14,45.72 10.84,46.02 7.18,46.02 7.03,45.87 OSC3.P$4 6.88,45.87 | 6.88,45.87 5.81,45.87 | 5.81,45.87 5.35,45.87 OSC3.P$1 | 27.6,9.6 29.43,9.6 33.09,13.26 R17.2 | 27.6,9.6 27.14,9.6 R18.2 | 21.96,18.9 18.76,15.7 18.76,13.26 C11.1 18.76,13.11 18.76,12.8 25.62,5.94 26.54,5.94 27.6,7.01 27.6,9.6 | 21.96,18.9 22.88,18.9 R31.2 | U$20.C10 18,39.93 22.88,39.93 24.86,37.95 25.47,37.95 U$64.4 25.62,37.8 v26.69,37.8 | 21.96,18.9 21.96,23.93 v19.68,26.21 | v15.87,37.03 14.95,37.95
VCC_1.8  (via drill 0.15)
  Top 0.152: v6.27,21.03 6.27,19.81 | 6.27,19.81 6.27,19.51 U$4.12 | 6.27,19.81 v2.61,19.81
  Bottom 0.152: v6.27,21.03 6.88,21.64 U$1.5 6.88,21.79 8.4,21.79 C30.1 | v2.61,19.81 2.61,20.57 R12.2
VCC_1.8_EN  (via drill 0.15)
  Top 0.152: v13.43,42.06 13.43,41 13.89,40.54 13.89,40.23 13.58,39.93 11.45,39.93 11.3,40.08 10.99,40.08 9.92,39.01 v9.92,32.31 | v5.35,25.76 v9.92,30.33
  Bottom 0.152: v13.43,42.06 13.73,42.37 U$20.F5 | v9.92,30.33 v9.92,32.31 | v5.35,25.76 5.35,24.69 4.28,23.62 U$1.3
VCC_LED  (via drill 0.15)
  Top 0.152: v14.04,31.7 14.04,30.94 U$5.29 | v27.14,25.3 v18.76,25.3 | v27.6,31.7 27.6,30.94 U$5.2
  Bottom 0.152: 28.56,26.32 27.3,27.58 C20.1 | v14.04,31.7 14.34,31.7 18.76,27.28 v18.76,25.3 | C19.1 28.21,25.3 v27.14,25.3 25.32,27.13 25.32,30.02 26.99,31.7 v27.6,31.7
  Bottom 0.381: D2.2 28.32,23.37 | 28.32,23.37 28.29,25.25 C19.1 28.35,26.11 28.56,26.32 R3.2 | C26.1 28.45,23.49 28.32,23.37
VCOMH
  Top 0.152: U$5.3 27.14,30.79 27.14,30.18 28.21,29.11 37.81,29.11 C22.1 37.97,28.96 37.97,27.74 C25.1
VDD
  Bottom 0.152: 5.35,6.71 IC1.6 5.35,6.55 5.66,6.55 5.81,6.4 5.81,4.27 5.66,4.12 TP21.TP 5.5,3.96 4.59,3.96 R5.2
VPA
  Top 0.152: C7.1 14.19,27.89 14.19,28.19 16.02,30.02 16.02,30.79 U$5.25
VPB
  Top 0.152: C21.1 15.41,27.89 15.41,28.96 16.48,30.02 16.48,30.79 U$5.24
VPC
  Top 0.152: C1.1 16.48,27.89 16.48,29.57 17.09,30.18 17.09,30.79 U$5.23
VSL  (via drill 0.15)
  Top 0.152: v25.77,29.87 26.08,30.18 26.08,30.79 U$5.5 | v30.8,30.02 32.63,31.85 R9.2
  Bottom 0.152: v25.77,29.87 30.65,29.87 v30.8,30.02

### Text on the board
_tsilk: U$12 | U$13 | C15 | C16 | U$18 | C14 | U$1 | C23 | C3 | U$7 | C2 | C9 | JP1 | C5 | R4 | C4 | U$4 | U$14 | C19 | C18 | R5 | D2 | C13 | C24 | C34 | U$5 | R3 | R6 | C21 | C6 | U$15 | C27 | C26 | C25 | C1 | C22 | C7 | C20 | D1 | R9 | R8 | LED1 | R7 | R11 | R12 | R13
_bsilk: U$2 | R17 | C31 | R18 | C30 | C29 | U$17 | C17 | R15 | C28 | R16 | R14 | U$16 | C12 | U$8 | R2 | C10 | C11 | U$6 | J2 | U$3 | R19 | U$10 | R1 | U$9